# Altium project Control BoardPrjPcb.PrjPcb (part 1 of 2)
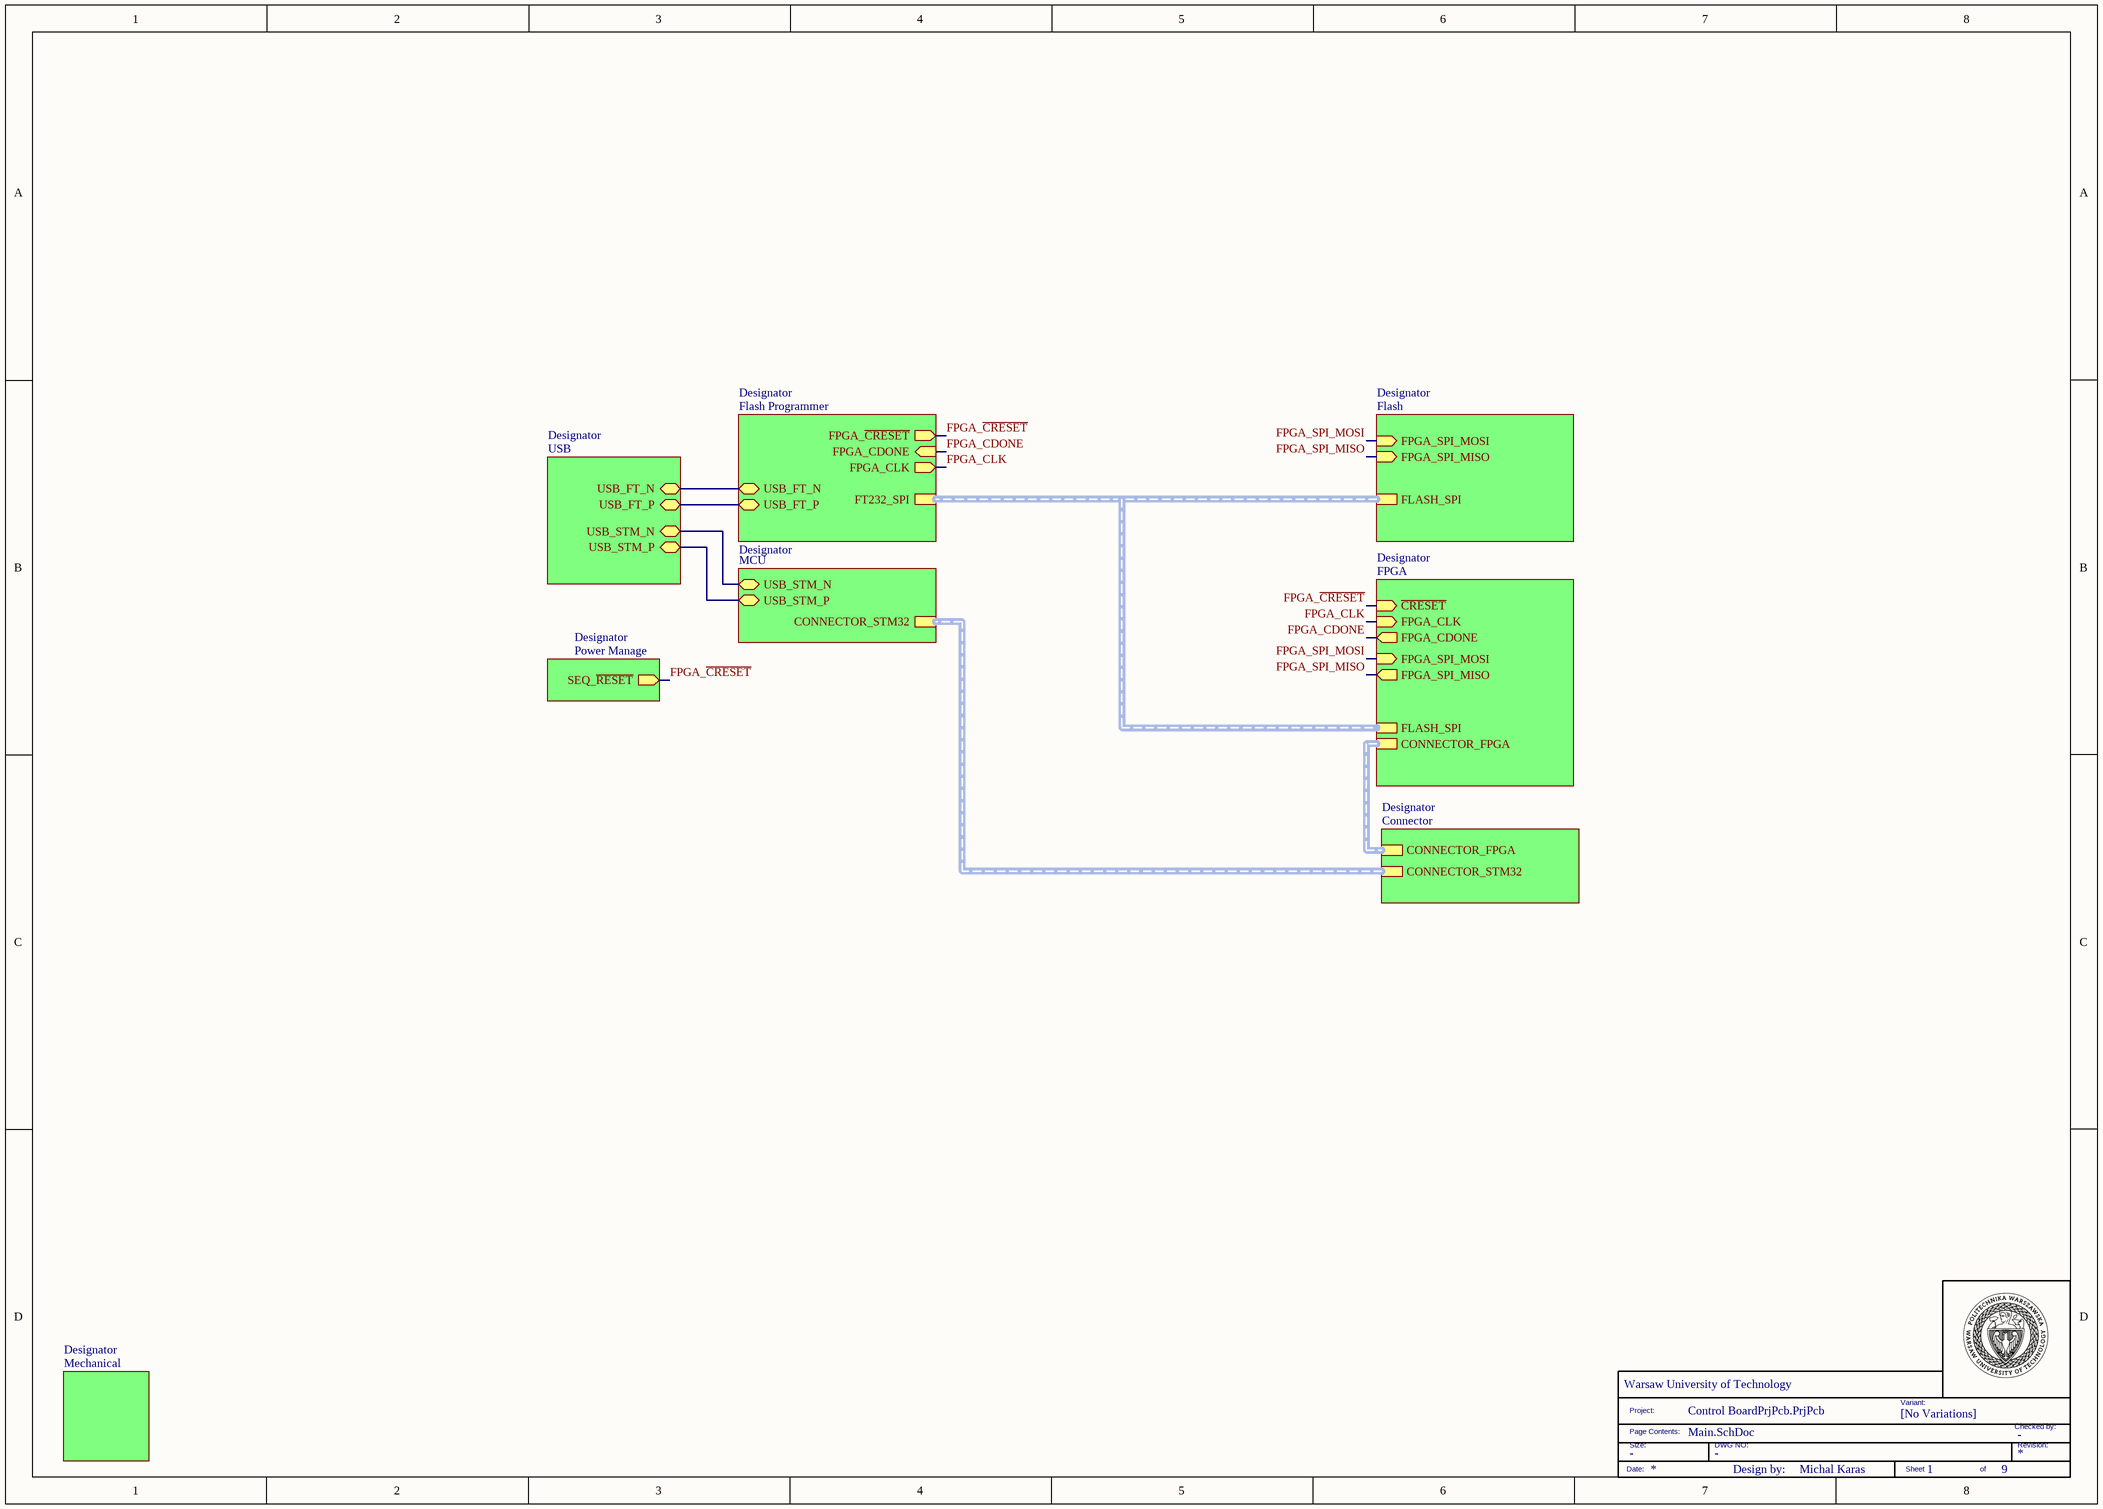
[diagram p0: Main.SchDoc]
9 sheets, 254 parts. Net scope: hierarchical (ports join the sheet entries above them; power ports are global).
Board file: Control Board.PcbDoc
Sheets:
  Main.SchDoc
    Designator = FPGA.SchDoc
    Designator = MCU.SchDoc
    Designator = Power Manage.SchDoc
    Designator = Mechanical.SchDoc
    Designator = USB.SchDoc
    Designator = Flash.SchDoc
    Designator = Flash Programmer.SchDoc
    Designator = Connector.SchDoc

## Sheet Main.SchDoc: CONTROL BOARD
size A3; Author: Michal Karas; CompanyName: Warsaw University of Technology; DrawnBy: Michal Karas; Engineer: Michal Karas; Organization: PW; SheetNumber: 1; SheetTotal: 9

### Parts
(Parts that share a designator on the sheet are numbered #1, #2 ... from top to bottom, then left to right.)
*#1  TITLE_BLOCK  (value not drawn)  (graphical)

### Sub-sheets
Designator = FPGA: ~{CRESET} (in), FPGA_CLK (in), FPGA_SPI_MOSI (in), FPGA_SPI_MISO (out), CONNECTOR_FPGA (harness CONNECTOR_FPGA), FPGA_CDONE (out), FLASH_SPI (harness FLASH_SPI)
Designator = MCU: USB_STM_N (bidir), USB_STM_P (bidir), CONNECTOR_STM32 (harness CONNECTOR_STM32)
Designator = Power Manage: SEQ_~{RESET} (out)
Designator = Mechanical: no entries
Designator = USB: USB_FT_N (bidir), USB_FT_P (bidir), USB_STM_N (bidir), USB_STM_P (bidir)
Designator = Flash: FPGA_SPI_MOSI (in), FPGA_SPI_MISO (in), FLASH_SPI (harness FLASH_SPI)
Designator = Flash Programmer: FPGA_~{CRESET} (out), FPGA_CDONE (in), FPGA_CLK (out), USB_FT_N (bidir), USB_FT_P (bidir), FT232_SPI (harness FLASH_SPI)
Designator = Connector: CONNECTOR_FPGA (harness CONNECTOR_FPGA), CONNECTOR_STM32 (harness CONNECTOR_STM32)

### Nets
FPGA_~{CRESET}: sheet Designator/~{CRESET}, sheet Designator/SEQ_~{RESET}, sheet Designator/FPGA_~{CRESET}  [project net ~{CRESET}]
FPGA_CDONE: sheet Designator/FPGA_CDONE, sheet Designator/FPGA_CDONE  [project net CDONE]
FPGA_CLK: sheet Designator/FPGA_CLK, sheet Designator/FPGA_CLK
FPGA_SPI_MISO: sheet Designator/FPGA_SPI_MISO, sheet Designator/FPGA_SPI_MISO
FPGA_SPI_MOSI: sheet Designator/FPGA_SPI_MOSI, sheet Designator/FPGA_SPI_MOSI
USB_FT_N: sheet Designator/USB_FT_N, sheet Designator/USB_FT_N
USB_FT_P: sheet Designator/USB_FT_P, sheet Designator/USB_FT_P
USB_STM_N: sheet Designator/USB_STM_N, sheet Designator/USB_STM_N
USB_STM_P: sheet Designator/USB_STM_P, sheet Designator/USB_STM_P

### Buses and harness runs
harness sheet Designator/FLASH_SPI = sheet Designator/FT232_SPI

### Notes on the sheet
- (in symbol CMP-003-000005-7) Variant:; Project:; [No Variations]; Checked by:; Page Contents:; Size:; DWG NO:; Revision:; Date:; Design by:; Sheet; of

### Library data of the parts
*#1 = CMP-003-000005-7: TITLEBLOCK; DWG NO: -; Size: -; Checked by: -; Design Item ID: TITLE_BLOCK; Source: TITLEBLOCK.SchLib

## Sheet FPGA.SchDoc
size A3; SheetNumber: 2; SheetTotal: 9
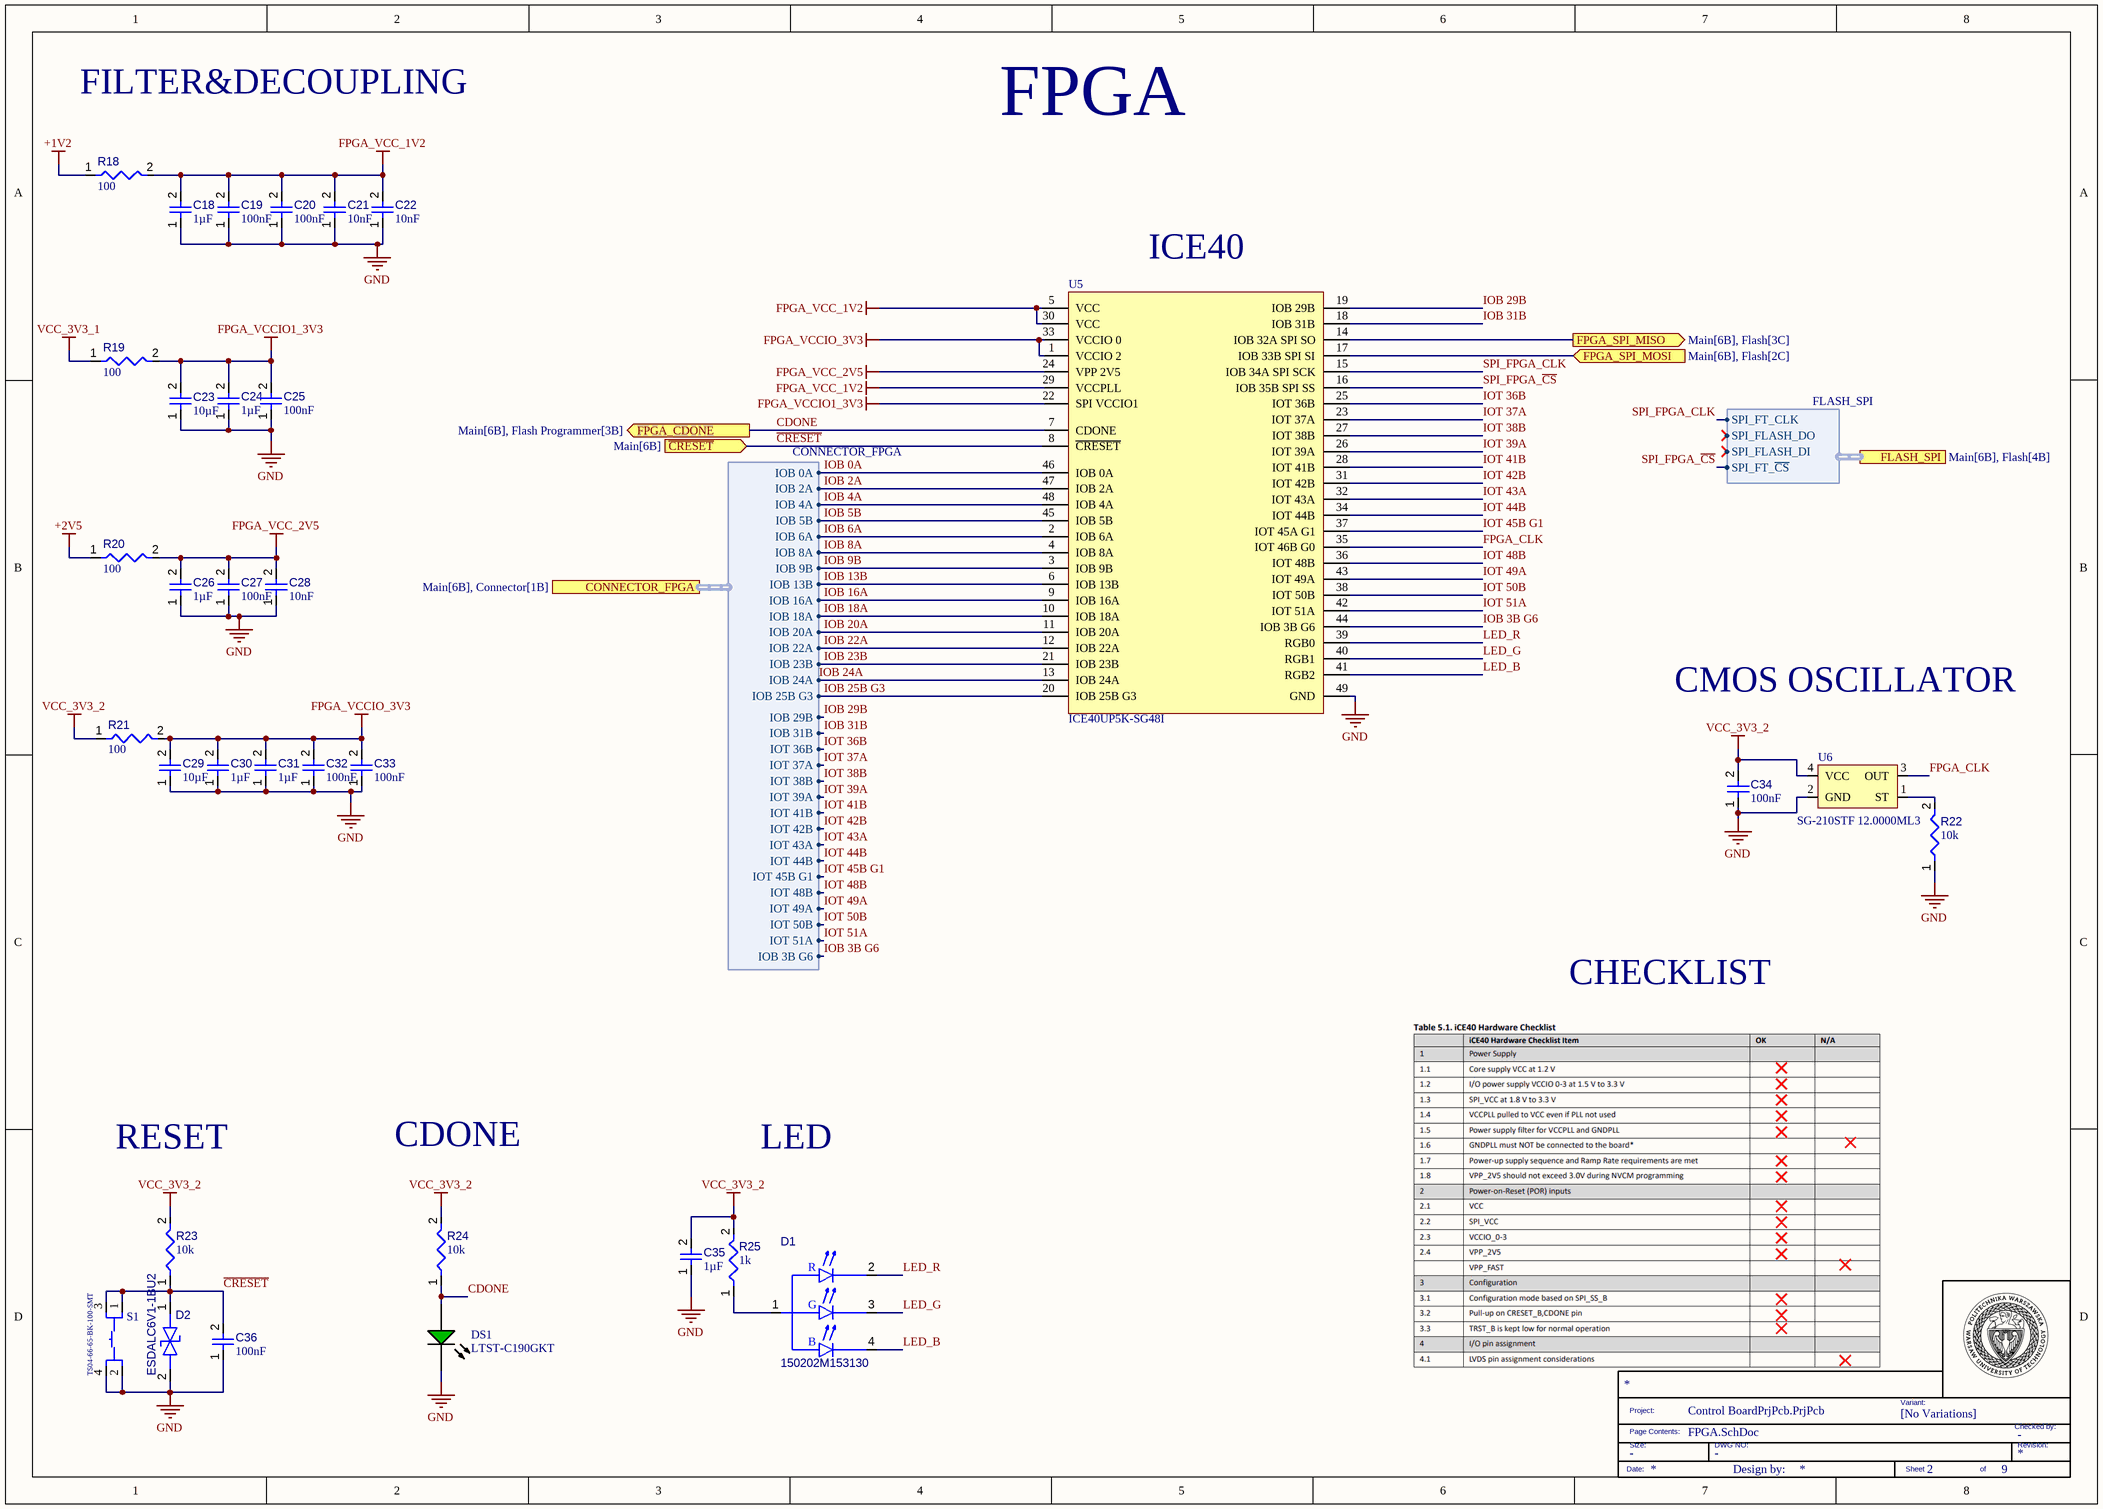
[diagram p1: FPGA.SchDoc]

### Parts
(Parts that share a designator on the sheet are numbered #1, #2 ... from top to bottom, then left to right.)
*?#1  TITLE_BLOCK  (value not drawn)  (graphical)
C18  value 1µF  [FP-CL10-IPC_C]  (hidden comment: CL10B105KA8NFNC)
C19  value 100nF  [FP-C0603C-CF-IPC_C]  (hidden comment: C0603C104K5RAC7411)
C20  value 100nF  [FP-C0603C-CF-IPC_C]  (hidden comment: C0603C104K5RAC7411)
C21  value 10nF  [CAPC1608X90X35LL10T15]  (hidden comment: GCM188R71H103KA37J)
C22  value 10nF  [CAPC1608X90X35LL10T15]  (hidden comment: GCM188R71H103KA37J)
C23  value 10µF  [FP-GRM188-0_2-IPC_C]  (hidden comment: GRM188R61C106MA73D)
C24  value 1µF  [FP-CL10-IPC_C]  (hidden comment: CL10B105KA8NFNC)
C25  value 100nF  [FP-C0603C-CF-IPC_C]  (hidden comment: C0603C104K5RAC7411)
C26  value 1µF  [FP-CL10-IPC_C]  (hidden comment: CL10B105KA8NFNC)
C27  value 100nF  [FP-C0603C-CF-IPC_C]  (hidden comment: C0603C104K5RAC7411)
C28  value 10nF  [CAPC1608X90X35LL10T15]  (hidden comment: GCM188R71H103KA37J)
C29  value 10µF  [FP-GRM188-0_2-IPC_C]  (hidden comment: GRM188R61C106MA73D)
C30  value 1µF  [FP-CL10-IPC_C]  (hidden comment: CL10B105KA8NFNC)
C31  value 1µF  [FP-CL10-IPC_C]  (hidden comment: CL10B105KA8NFNC)
C32  value 100nF  [FP-C0603C-CF-IPC_C]  (hidden comment: C0603C104K5RAC7411)
C33  value 100nF  [FP-C0603C-CF-IPC_C]  (hidden comment: C0603C104K5RAC7411)
C34  value 100nF  [FP-C0603C-CF-IPC_C]  (hidden comment: C0603C104K5RAC7411)
C35  value 1µF  [FP-CL10-IPC_C]  (hidden comment: CL10B105KA8NFNC)
C36  value 100nF  [FP-C0603C-CF-IPC_C]  (hidden comment: C0603C104K5RAC7411)
D1  150202M153130  [150202M153130-Footprint-1]
D2  ESDALC6V1-1BU2  [DIOC0603X03N]
DS1  LTST-C190GKT  [LTST-C190GKT_V]
R18  value 100  [RESC1608X06N]  (hidden comment: CRCW0603100RFKEAHP)
R19  value 100  [RESC1608X06N]  (hidden comment: CRCW0603100RFKEAHP)
R20  value 100  [RESC1608X06N]  (hidden comment: CRCW0603100RFKEAHP)
R21  value 100  [RESC1608X06N]  (hidden comment: CRCW0603100RFKEAHP)
R22  value 10k  [RESC1608X05N]  (hidden comment: CRCW060310K0FKTC)
R23  value 10k  [RESC1608X05N]  (hidden comment: CRCW060310K0FKTC)
R24  value 10k  [RESC1608X05N]  (hidden comment: CRCW060310K0FKTC)
R25  value 1k  [RESC1608X55X25LL10T15]  (hidden comment: Resistor 1k +/-1% 0603 100 mW)
S1  TS04-66-65-BK-100-SMT  [SW_TS04-66-65-BK-100-SMT]
U5  ICE40UP5K-SG48I  [FP-QFN-48-IPC_B]
U6  SG-210STF 12.0000ML3  [SG-210STF 12.0000ML3-Footprint-1]

### Ports
CONNECTOR_FPGA (harness CONNECTOR_FPGA, see Main[6B], Connector[1B]), FLASH_SPI (harness FLASH_SPI, see Main[6B], Flash[4B]), FPGA_CDONE (out, see Main[6B], Flash Programmer[3B]), FPGA_SPI_MISO (out, see Main[6B], Flash[3C]), FPGA_SPI_MOSI (in, see Main[6B], Flash[2C]), ~{CRESET} (in, see Main[6B])

### Harnesses
CONNECTOR_FPGA: IOB 0A, IOB 2A, IOB 4A, IOB 5B, IOB 6A, IOB 8A, IOB 9B, IOB 13B, IOB 16A, IOB 18A, IOB 20A, IOB 22A, IOB 23B, IOB 24A, IOB 25B G3, IOB 29B, IOB 31B, IOT 36B, IOT 37A, IOT 38B, IOT 39A, IOT 41B, IOT 42B, IOT 43A, IOT 44B, IOT 45B G1, IOT 48B, IOT 49A, IOT 50B, IOT 51A, IOB 3B G6
FLASH_SPI: SPI_FT_CLK, SPI_FLASH_DO, SPI_FLASH_DI, SPI_FT_~{CS}

### Nets
+1V2: R18.1
+2V5: R20.1
FPGA_VCC_1V2: C18.2 C19.2 C20.2 C21.2 C22.2 R18.2 U5.5(VCC) U5.29(VCCPLL) U5.30(VCC)
FPGA_VCC_2V5: C26.2 C27.2 C28.2 R20.2 U5.24(VPP_2V5)
FPGA_VCCIO1_3V3: C23.2 C24.2 C25.2 R19.2 U5.22(SPI_VCCIO1)
FPGA_VCCIO_3V3: C29.2 C30.2 C31.2 C32.2 C33.2 R21.2 U5.1(VCCIO_2) U5.33(VCCIO_0)
GND: C18.1 C19.1 C20.1 C21.1 C22.1 C23.1 C24.1 C25.1 C26.1 C27.1 C28.1 C29.1 C30.1 C31.1 C32.1 C33.1 C34.1 C35.1 C36.1 D2.2(A) DS1.2(K) R22.1 S1.2 S1.4 U5.49(GND) U6.2(GND)
VCC_3V3_1: R19.1
VCC_3V3_2: C34.2 C35.2 R21.1 R23.2 R24.2 R25.2 U6.4(VCC)
~{CRESET}: C36.2 D2.1(K) R23.1 S1.1 S1.3 U5.8(~{CRESET}) ; port ~{CRESET}
CDONE: DS1.1(A) R24.1 U5.7(CDONE) ; port FPGA_CDONE
FPGA_CLK: U5.35(IOT_46B_G0) U6.3(OUT)
FPGA_SPI_MISO: U5.14(IOB_32A_SPI_SO) ; port FPGA_SPI_MISO
FPGA_SPI_MOSI: U5.17(IOB_33B_SPI_SI) ; port FPGA_SPI_MOSI
IOB 0A: U5.46(IOB_0A) ; port CONNECTOR_FPGA.IOB 0A
IOB 2A: U5.47(IOB_2A) ; port CONNECTOR_FPGA.IOB 2A
IOB 3B G6: U5.44(IOB_3B_G6) ; port CONNECTOR_FPGA.IOB 3B G6
IOB 4A: U5.48(IOB_4A) ; port CONNECTOR_FPGA.IOB 4A
IOB 5B: U5.45(IOB_5B) ; port CONNECTOR_FPGA.IOB 5B
IOB 6A: U5.2(IOB_6A) ; port CONNECTOR_FPGA.IOB 6A
IOB 8A: U5.4(IOB_8A) ; port CONNECTOR_FPGA.IOB 8A
IOB 9B: U5.3(IOB_9B) ; port CONNECTOR_FPGA.IOB 9B
IOB 13B: U5.6(IOB_13B) ; port CONNECTOR_FPGA.IOB 13B
IOB 16A: U5.9(IOB_16A) ; port CONNECTOR_FPGA.IOB 16A
IOB 18A: U5.10(IOB_18A) ; port CONNECTOR_FPGA.IOB 18A
IOB 20A: U5.11(IOB_20A) ; port CONNECTOR_FPGA.IOB 20A
IOB 22A: U5.12(IOB_22A) ; port CONNECTOR_FPGA.IOB 22A
IOB 23B: U5.21(IOB_23B) ; port CONNECTOR_FPGA.IOB 23B
IOB 24A: U5.13(IOB_24A) ; port CONNECTOR_FPGA.IOB 24A
IOB 25B G3: U5.20(IOB_25B_G3) ; port CONNECTOR_FPGA.IOB 25B G3
IOB 29B: U5.19(IOB_29B) ; port CONNECTOR_FPGA.IOB 29B
IOB 31B: U5.18(IOB_31B) ; port CONNECTOR_FPGA.IOB 31B
IOT 36B: U5.25(IOT_36B) ; port CONNECTOR_FPGA.IOT 36B
IOT 37A: U5.23(IOT_37A) ; port CONNECTOR_FPGA.IOT 37A
IOT 38B: U5.27(IOT_38B) ; port CONNECTOR_FPGA.IOT 38B
IOT 39A: U5.26(IOT_39A) ; port CONNECTOR_FPGA.IOT 39A
IOT 41B: U5.28(IOT_41B) ; port CONNECTOR_FPGA.IOT 41B
IOT 42B: U5.31(IOT_42B) ; port CONNECTOR_FPGA.IOT 42B
IOT 43A: U5.32(IOT_43A) ; port CONNECTOR_FPGA.IOT 43A
IOT 44B: U5.34(IOT_44B) ; port CONNECTOR_FPGA.IOT 44B
IOT 45B G1: U5.37(IOT_45A_G1) ; port CONNECTOR_FPGA.IOT 45B G1
IOT 48B: U5.36(IOT_48B) ; port CONNECTOR_FPGA.IOT 48B
IOT 49A: U5.43(IOT_49A) ; port CONNECTOR_FPGA.IOT 49A
IOT 50B: U5.38(IOT_50B) ; port CONNECTOR_FPGA.IOT 50B
IOT 51A: U5.42(IOT_51A) ; port CONNECTOR_FPGA.IOT 51A
LED_B: D1.4(K) U5.41(RGB2)
LED_G: D1.3(K) U5.40(RGB1)
LED_R: D1.2(A) U5.39(RGB0)
SPI_FPGA_~{CS}: U5.16(IOB_35B_SPI_SS) ; port FLASH_SPI.SPI_FT_~{CS}
SPI_FPGA_CLK: U5.15(IOB_34A_SPI_SCK) ; port FLASH_SPI.SPI_FT_CLK  [project net FLASH_SPI_SCK]
NetD1_1: D1.1(A) R25.1
NetR22_2: R22.2 U6.1(ST)

### Notes on the sheet
- FILTER&DECOUPLING
- FPGA
- (near U5) ICE40
- CMOS OSCILLATOR
- CHECKLIST
- RESET
- CDONE
- LED
- Rpullup=1/(2*ConfigFrequency*CDONETraceCap)
- CDONE IS 1 IF FPGA IS CONFIGURED
- (in symbol CMP-003-000005-7) Variant:; Project:; [No Variations]; Checked by:; Page Contents:; Size:; DWG NO:; Revision:; Date:; Design by:; Sheet; of
- (in symbol CMP-007-00037-1) R; G; B

### Library data of the parts
*?#1 = CMP-003-000005-7: TITLEBLOCK; DWG NO: -; Size: -; Checked by: -; Design Item ID: TITLE_BLOCK; Source: TITLEBLOCK.SchLib
C18 C24 C26 C30 C31 C35 = CMP-001-00085-5: Ceramic Capacitor, Multilayer, Ceramic, 25V, 10% +Tol, 10% -Tol, X7R, 15% TC, 1uF, Surface Mount, 0603; Max Operating Temperature: 125°C; Pins: 2; RoHS Compliant: Yes; Min Operating Temperature: -55°C; Capacitor Type: Ceramic; Mounting Technology: Surface Mount; Case/Package: 0603
C19 C20 = CMP-001-00086-4: Ceramic Capacitor, Multilayer, Ceramic, 50V, 10% +Tol, 10% -Tol, X7R, 15% TC, 0.1uF, Surface Mount, 0603; Capacitor Type: Ceramic; Max Operating Temperature: 125°C; Case/Package: 0603; Pins: 2; Min Operating Temperature: -55°C; RoHS Compliant: Yes; Mounting Technology: Surface Mount
C21 C22 C28 = CMP-001-00231-2: Ceramic Capacitor, Multilayer, Ceramic, 50V, 10% +Tol, 10% -Tol, X7R, 15% TC, 0.01uF, Surface Mount, 0603; Min Operating Temperature: -55°C; Voltage Rating: 50V; Max Operating Temperature: 125°C; Tolerance: 10%; Capacitor Type: Ceramic; Mounting Technology: Surface Mount; RoHS Compliant: Yes; Case/Package: 0603; Pins: 2
C23 C29 = CMP-001-00241-5: Ceramic Capacitor, Multilayer, Ceramic, 16V, 20% +Tol, 20% -Tol, X5R, 15% TC, 10uF, Surface Mount, 0603; Min Operating Temperature: -55°C; Capacitor Type: Ceramic; RoHS Compliant: Yes; Max Operating Temperature: 85°C; Case/Package: 0603; Mounting Technology: Surface Mount; Pins: 2
C25 C27 C32-C34 C36 = CMP-001-00086-8: Ceramic Capacitor, Multilayer, Ceramic, 50V, 10% +Tol, 10% -Tol, X7R, 15% TC, 0.1uF, Surface Mount, 0603; Capacitor Type: Ceramic; Max Operating Temperature: 125°C; Case/Package: 0603; Pins: 2; Min Operating Temperature: -55°C; RoHS Compliant: Yes; Mounting Technology: Surface Mount
D1 = CMP-007-00037-1: Standard LEDs - SMD WL-SFTD Diffsd TopVw RGB 3.2V 20mA 635nm; Max Power Dissipation: 72mW; Min Operating Temperature: -40°C; Max Operating Temperature: 85°C; Pins: 4; Forward Voltage: 3.2V; Forward Current: 20mA; Colour: RGB; Nominal Vf: 3.2V
D2 = CMP-004-00032-2: Trans Voltage Suppressor Diode, Bidirectional, 1 Element, Silicon; Forward Current: 100nA; Peak Inverse Voltage: 6.1V; Forward Voltage: 3V; Max Surge Current: 1.5A; Max Operating Temperature: 125°C; Min Operating Temperature: -40°C; Case/Package: 0201; Pins: 2; RoHS Compliant: Yes
DS1 = CMP-007-00022-2: LED Uni-Color Green, 100 mW, 30 mA, -55 to 85 degC, 2-Pin SMD, RoHS, Tape and Reel; Manufacturer: Lite-On; Power: 100mW; Forward Voltage: 2.1V; Viewing Angle: 130degrees; Forward Current: 20mA; Luminous Intensity: 6mcd; Lens Style: Clear; Manufacturer URL: http://www.us.liteon.com/; RoHS Compliant: True; Colour: Green; Package Description: 2-Pin Surface Mount Device, Body 1.6 x 0.8 mm; Datasheet URL: http://datasheet.octopart.com/LTST-C190GKT-Lite-On-datasheet-158530.pdf; Datasheet Version: Dec-06; Mounting Technology: SM; Case/Package: 0603; Package Reference: C190GKT; Packaging: TapeandReel; Min Operating Temperature: -55°C; Nominal Vf: 2.1V; Package Quantity: 3000; Illumination Colour: Green; Max Operating Temperature: 85°C; Pins: 2
R18-R21 = CMP-009-00188-2: Fixed Resistor, Metal Glaze/thick Film, 0.33W, 100ohm, 75V, 1% +/-Tol, 100ppm/Cel, Surface Mount, 0603; Power: 250mW; Pins: 2; Case/Package: 0603; Max Operating Temperature: 155°C; Tolerance: 1%; Min Operating Temperature: -55°C; Mounting Technology: Surface Mount; RoHS Compliant: Yes
R22 R23 = CMP-009-00187-2: Fixed Resistor, Metal Glaze/thick Film, 0.1W, 10000ohm, 75V, 1% +/-Tol, 100ppm/Cel, Surface Mount, 0603; Power: 100mW; Voltage Rating: 75V; Case/Package: 0603; Tolerance: 1%; Min Operating Temperature: -55°C; Mounting Technology: Surface Mount; Max Operating Temperature: 155°C; RoHS Compliant: No; Pins: 2
R24 = CMP-009-00187-3: Fixed Resistor, Metal Glaze/thick Film, 0.1W, 10000ohm, 75V, 1% +/-Tol, 100ppm/Cel, Surface Mount, 0603; Power: 100mW; Voltage Rating: 75V; Case/Package: 0603; Tolerance: 1%; Min Operating Temperature: -55°C; Mounting Technology: Surface Mount; Max Operating Temperature: 155°C; RoHS Compliant: No; Pins: 2
R25 = CMP-009-00014-6: Chip Resistor, 1 KOhm, +/-1%, 0.1 W, -55 to 155 degC, 0603 (1608 Metric); Voltage Rating: 50V; Power: 100mW; Tolerance: 1%; Mounting Technology: SM; Pins: 2; Case/Package: 0603; Min Operating Temperature: -55°C; RoHS Compliant: True; Max Operating Temperature: 155°C
S1 = CMP-015-000000-3: Switch Tactile OFF (ON) SPST Round Button Gull Wing 0.05A 12VDC 100000Cycles 1N SMD Bag; Package: None; MP: TS04-66-65-BK-100-SMT; Availability: Unavailable; Source: TS04-66-65-BK-100-SMT.SchLib; Pin Count: 4; Design Item ID: TS04-66-65-BK-100-SMT; Value: *; Component Type: Standard; Price: None
U5 = CMP-020-00024-5: Field Programmable Gate Array; Min Supply Voltage: 1.2V; Max Supply Voltage: 3.6V; I/Os: 39; Clock Frequency: 50MHz; RoHS Compliant: Yes; Case/Package: QFN; Pins: 49; Frequency: 50MHz
U6 = CMP-003-00030-6: CMOS Output Clock Oscillator, 12MHz Nom; Load Capacitance: 15pF; Frequency: 12MHz; Max Operating Temperature: 85°C; Min Operating Temperature: -40°C; Pins: 4

## Sheet MCU.SchDoc
size A3; SheetNumber: 3; SheetTotal: 9
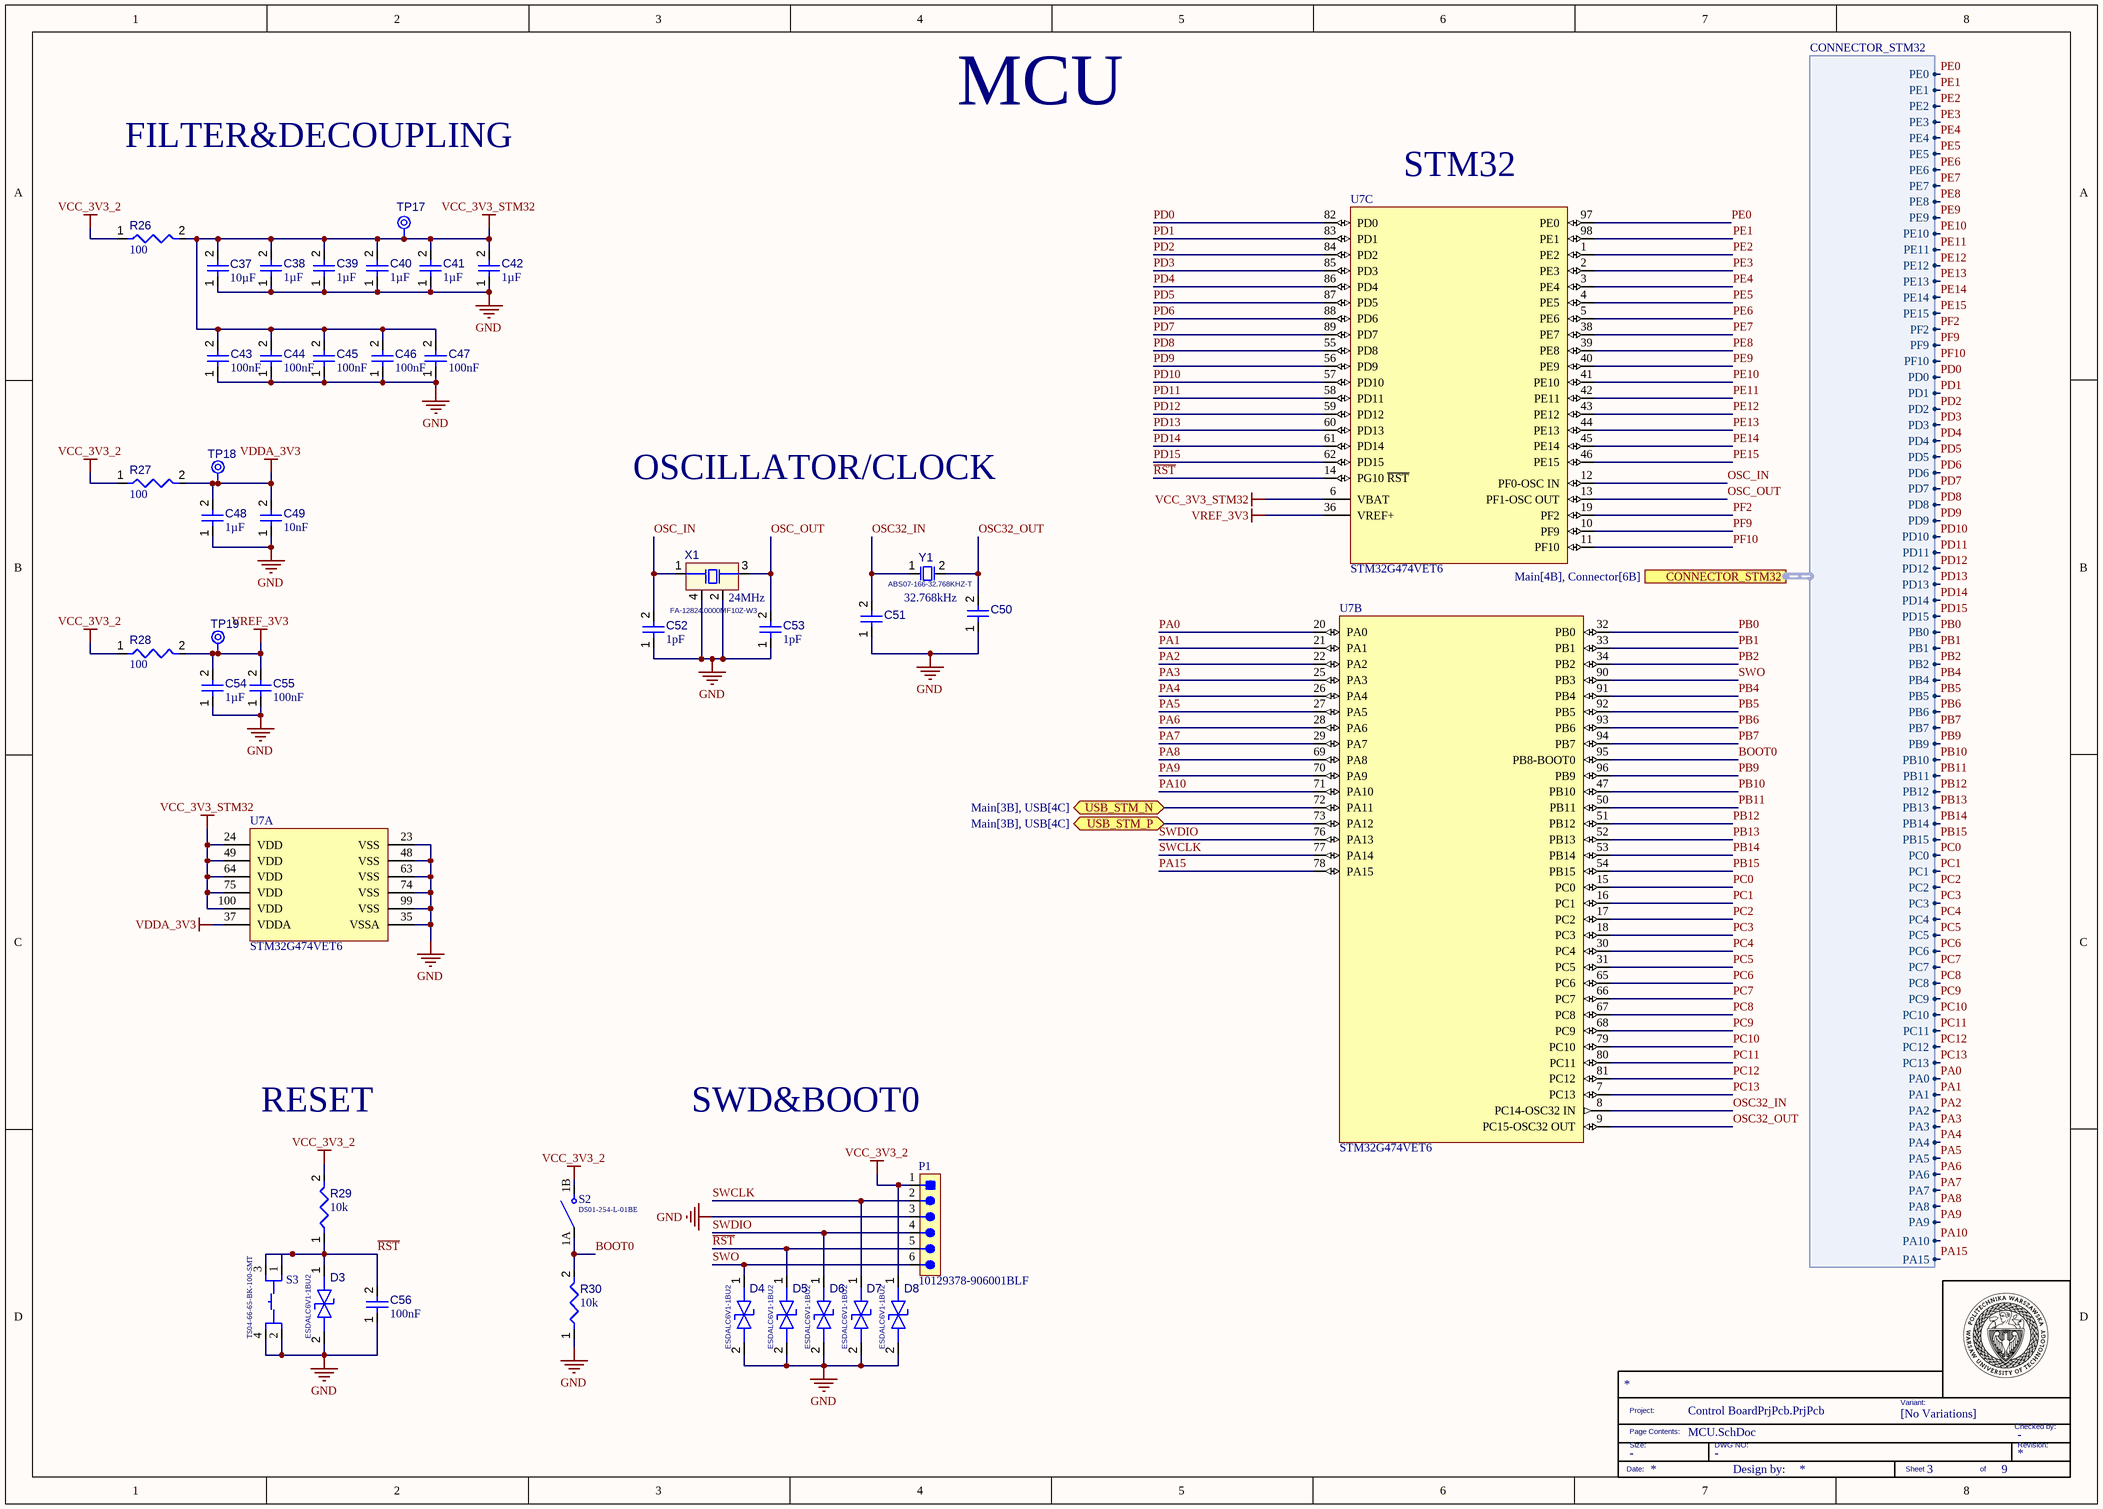
[diagram p2: MCU.SchDoc]

### Parts
(Parts that share a designator on the sheet are numbered #1, #2 ... from top to bottom, then left to right.)
*?#2  TITLE_BLOCK  (value not drawn)  (graphical)
C37  value 10µF  [FP-GRM188-0_2-IPC_C]  (hidden comment: GRM188R61C106MA73D)
C38  value 1µF  [FP-CL10-IPC_C]  (hidden comment: CL10B105KA8NFNC)
C39  value 1µF  [FP-CL10-IPC_C]  (hidden comment: CL10B105KA8NFNC)
C40  value 1µF  [FP-CL10-IPC_C]  (hidden comment: CL10B105KA8NFNC)
C41  value 1µF  [FP-CL10-IPC_C]  (hidden comment: CL10B105KA8NFNC)
C42  value 1µF  [FP-CL10-IPC_C]  (hidden comment: CL10B105KA8NFNC)
C43  value 100nF  [FP-C0603C-CF-IPC_C]  (hidden comment: C0603C104K5RAC7411)
C44  value 100nF  [FP-C0603C-CF-IPC_C]  (hidden comment: C0603C104K5RAC7411)
C45  value 100nF  [FP-C0603C-CF-IPC_C]  (hidden comment: C0603C104K5RAC7411)
C46  value 100nF  [FP-C0603C-CF-IPC_C]  (hidden comment: C0603C104K5RAC7411)
C47  value 100nF  [FP-C0603C-CF-IPC_C]  (hidden comment: C0603C104K5RAC7411)
C48  value 1µF  [FP-CL10-IPC_C]  (hidden comment: CL10B105KA8NFNC)
C49  value 10nF  [CAPC1608X90X35LL10T15]  (hidden comment: GCM188R71H103KA37J)
C50  C0402C479D8HACAUTO  [FP-C0402-BB-MFG]  (value not drawn)
C51  C0402C479D8HACAUTO  [FP-C0402-BB-MFG]  (value not drawn)
C52  value 1pF  [CAPC1005X06N]  (hidden comment: CBR04C109B5GACAUTO)
C53  value 1pF  [CAPC1005X06N]  (hidden comment: CBR04C109B5GACAUTO)
C54  value 1µF  [FP-CL10-IPC_C]  (hidden comment: CL10B105KA8NFNC)
C55  value 100nF  [FP-C0603C-CF-IPC_C]  (hidden comment: C0603C104K5RAC7411)
C56  value 100nF  [FP-C0603C-CF-IPC_C]  (hidden comment: C0603C104K5RAC7411)
D3  ESDALC6V1-1BU2  [DIOC0603X03N]
D4  ESDALC6V1-1BU2  [DIOC0603X03N]
D5  ESDALC6V1-1BU2  [DIOC0603X03N]
D6  ESDALC6V1-1BU2  [DIOC0603X03N]
D7  ESDALC6V1-1BU2  [DIOC0603X03N]
D8  ESDALC6V1-1BU2  [DIOC0603X03N]
P1  10129378-906001BLF  [10129378-906001BLF-Footprint-1]
R26  value 100  [RESC1608X06N]  (hidden comment: CRCW0603100RFKEAHP)
R27  value 100  [RESC1608X06N]  (hidden comment: CRCW0603100RFKEAHP)
R28  value 100  [RESC1608X06N]  (hidden comment: CRCW0603100RFKEAHP)
R29  value 10k  [RESC1608X05N]  (hidden comment: CRCW060310K0FKTC)
R30  value 10k  [RESC1608X05N]  (hidden comment: CRCW060310K0FKTC)
S2  DS01-254-L-01BE  [SW_DS01-254-L-01BE]
S3  TS04-66-65-BK-100-SMT  [SW_TS04-66-65-BK-100-SMT]
TP17  TPAD6R  [TP06R]  (value not drawn)  (no BOM)
TP18  TPAD6R  [TP06R]  (value not drawn)  (no BOM)
TP19  TPAD6R  [TP06R]  (value not drawn)  (no BOM)
U7  STM32G474VET6  [FP-LQFP100-1L-IPC_B]  (parts A,B,C of 3)
X1  FA-12824.0000MF10Z-W3  Frequency: 24MHz  [EPSON-FA-128_V]
Y1  ABS07-166-32.768KHZ-T  Frequency: 32.768kHz  [EPSON-FC-135_V]

### Ports
CONNECTOR_STM32 (harness CONNECTOR_STM32, see Main[4B], Connector[6B]), USB_STM_N (bidir, see Main[3B], USB[4C]), USB_STM_P (bidir, see Main[3B], USB[4C])

### Harnesses
CONNECTOR_STM32: PE0, PE1, PE2, PE3, PE4, PE5, PE6, PE7, PE8, PE9, PE10, PE11, PE12, PE13, PE14, PE15, PF2, PF9, PF10, PD0, PD1, PD2, PD3, PD4, PD5, PD6, PD7, PD8, PD9, PD10, PD11, PD12, PD13, PD14, PD15, PB0, PB1, PB2, PB4, PB5, PB6, PB7, PB9, PB10, PB11, PB12, PB13, PB14, PB15, PC0, PC1, PC2, PC3, PC4, PC5, PC6, PC7, PC8, PC9, PC10, PC11, PC12, PC13, PA0, PA1, PA2, PA3, PA4, PA5, PA6, PA7, PA8, PA9, PA10, PA15

### Nets
GND: C37.1 C38.1 C39.1 C40.1 C41.1 C42.1 C43.1 C44.1 C45.1 C46.1 C47.1 C48.1 C49.1 C50.1 C51.1 C52.1 C53.1 C54.1 C55.1 C56.1 D3.2(A) D4.2(A) D5.2(A) D6.2(A) D7.2(A) D8.2(A) P1.3 R30.1 S3.2 S3.4 U7.23(VSS) U7.35(VSSA) U7.48(VSS) U7.63(VSS) U7.74(VSS) U7.99(VSS) X1.2(NC) X1.4(NC)
VCC_3V3_2: D8.1(K) P1.1 R26.1 R27.1 R28.1 R29.2 S2.1B(NO1)
VCC_3V3_STM32: C37.2 C38.2 C39.2 C40.2 C41.2 C42.2 C43.2 C44.2 C45.2 C46.2 C47.2 R26.2 TP17.1(TP) U7.6(VBAT) U7.24(VDD) U7.49(VDD) U7.64(VDD) U7.75(VDD) U7.100(VDD)
VDDA_3V3: C48.2 C49.2 R27.2 TP18.1(TP) U7.37(VDDA)
VREF_3V3: C54.2 C55.2 R28.2 TP19.1(TP) U7.36(VREF+)
~{RST}: C56.2 D3.1(K) D5.1(K) P1.5 R29.1 S3.1 S3.3 U7.14(PG10_~{RST})
BOOT0: R30.2 S2.1A(COM1) U7.95(PB8-BOOT0)
OSC32_IN: C51.2 U7.8(PC14-OSC32_IN) Y1.1
OSC32_OUT: C50.2 U7.9(PC15-OSC32_OUT) Y1.2
OSC_IN: C52.2 U7.12(PF0-OSC_IN) X1.1(X1)
OSC_OUT: C53.2 U7.13(PF1-OSC_OUT) X1.3(X2)
PA0: U7.20(PA0) ; port CONNECTOR_STM32.PA0
PA1: U7.21(PA1) ; port CONNECTOR_STM32.PA1
PA2: U7.22(PA2) ; port CONNECTOR_STM32.PA2
PA3: U7.25(PA3) ; port CONNECTOR_STM32.PA3
PA4: U7.26(PA4) ; port CONNECTOR_STM32.PA4
PA5: U7.27(PA5) ; port CONNECTOR_STM32.PA5
PA6: U7.28(PA6) ; port CONNECTOR_STM32.PA6
PA7: U7.29(PA7) ; port CONNECTOR_STM32.PA7
PA8: U7.69(PA8) ; port CONNECTOR_STM32.PA8
PA9: U7.70(PA9) ; port CONNECTOR_STM32.PA9
PA10: U7.71(PA10) ; port CONNECTOR_STM32.PA10
PA15: U7.78(PA15) ; port CONNECTOR_STM32.PA15
PB0: U7.32(PB0) ; port CONNECTOR_STM32.PB0
PB1: U7.33(PB1) ; port CONNECTOR_STM32.PB1
PB2: U7.34(PB2) ; port CONNECTOR_STM32.PB2
PB4: U7.91(PB4) ; port CONNECTOR_STM32.PB4
PB5: U7.92(PB5) ; port CONNECTOR_STM32.PB5
PB6: U7.93(PB6) ; port CONNECTOR_STM32.PB6
PB7: U7.94(PB7) ; port CONNECTOR_STM32.PB7
PB9: U7.96(PB9) ; port CONNECTOR_STM32.PB9
PB10: U7.47(PB10) ; port CONNECTOR_STM32.PB10
PB11: U7.50(PB11) ; port CONNECTOR_STM32.PB11
PB12: U7.51(PB12) ; port CONNECTOR_STM32.PB12
PB13: U7.52(PB13) ; port CONNECTOR_STM32.PB13
PB14: U7.53(PB14) ; port CONNECTOR_STM32.PB14
PB15: U7.54(PB15) ; port CONNECTOR_STM32.PB15
PC0: U7.15(PC0) ; port CONNECTOR_STM32.PC0
PC1: U7.16(PC1) ; port CONNECTOR_STM32.PC1
PC2: U7.17(PC2) ; port CONNECTOR_STM32.PC2
PC3: U7.18(PC3) ; port CONNECTOR_STM32.PC3
PC4: U7.30(PC4) ; port CONNECTOR_STM32.PC4
PC5: U7.31(PC5) ; port CONNECTOR_STM32.PC5
PC6: U7.65(PC6) ; port CONNECTOR_STM32.PC6
PC7: U7.66(PC7) ; port CONNECTOR_STM32.PC7
PC8: U7.67(PC8) ; port CONNECTOR_STM32.PC8
PC9: U7.68(PC9) ; port CONNECTOR_STM32.PC9
PC10: U7.79(PC10) ; port CONNECTOR_STM32.PC10
PC11: U7.80(PC11) ; port CONNECTOR_STM32.PC11
PC12: U7.81(PC12) ; port CONNECTOR_STM32.PC12
PC13: U7.7(PC13) ; port CONNECTOR_STM32.PC13
PD0: U7.82(PD0) ; port CONNECTOR_STM32.PD0
PD1: U7.83(PD1) ; port CONNECTOR_STM32.PD1
PD2: U7.84(PD2) ; port CONNECTOR_STM32.PD2
PD3: U7.85(PD3) ; port CONNECTOR_STM32.PD3
PD4: U7.86(PD4) ; port CONNECTOR_STM32.PD4
PD5: U7.87(PD5) ; port CONNECTOR_STM32.PD5
PD6: U7.88(PD6) ; port CONNECTOR_STM32.PD6
PD7: U7.89(PD7) ; port CONNECTOR_STM32.PD7
PD8: U7.55(PD8) ; port CONNECTOR_STM32.PD8
PD9: U7.56(PD9) ; port CONNECTOR_STM32.PD9
PD10: U7.57(PD10) ; port CONNECTOR_STM32.PD10
PD11: U7.58(PD11) ; port CONNECTOR_STM32.PD11
PD12: U7.59(PD12) ; port CONNECTOR_STM32.PD12
PD13: U7.60(PD13) ; port CONNECTOR_STM32.PD13
PD14: U7.61(PD14) ; port CONNECTOR_STM32.PD14
PD15: U7.62(PD15) ; port CONNECTOR_STM32.PD15
PE0: U7.97(PE0) ; port CONNECTOR_STM32.PE0
PE1: U7.98(PE1) ; port CONNECTOR_STM32.PE1
PE2: U7.1(PE2) ; port CONNECTOR_STM32.PE2
PE3: U7.2(PE3) ; port CONNECTOR_STM32.PE3
PE4: U7.3(PE4) ; port CONNECTOR_STM32.PE4
PE5: U7.4(PE5) ; port CONNECTOR_STM32.PE5
PE6: U7.5(PE6) ; port CONNECTOR_STM32.PE6
PE7: U7.38(PE7) ; port CONNECTOR_STM32.PE7
PE8: U7.39(PE8) ; port CONNECTOR_STM32.PE8
PE9: U7.40(PE9) ; port CONNECTOR_STM32.PE9
PE10: U7.41(PE10) ; port CONNECTOR_STM32.PE10
PE11: U7.42(PE11) ; port CONNECTOR_STM32.PE11
PE12: U7.43(PE12) ; port CONNECTOR_STM32.PE12
PE13: U7.44(PE13) ; port CONNECTOR_STM32.PE13
PE14: U7.45(PE14) ; port CONNECTOR_STM32.PE14
PE15: U7.46(PE15) ; port CONNECTOR_STM32.PE15
PF2: U7.19(PF2) ; port CONNECTOR_STM32.PF2
PF9: U7.10(PF9) ; port CONNECTOR_STM32.PF9
PF10: U7.11(PF10) ; port CONNECTOR_STM32.PF10
SWCLK: D7.1(K) P1.2 U7.77(PA14)
SWDIO: D6.1(K) P1.4 U7.76(PA13)
SWO: D4.1(K) P1.6 U7.90(PB3)
USB_STM_N: U7.72(PA11) ; port USB_STM_N
USB_STM_P: U7.73(PA12) ; port USB_STM_P

### Notes on the sheet
- FILTER&DECOUPLING
- MCU
- (near U7) STM32
- OSCILLATOR/CLOCK
- Battery not used
- RESET
- SWD&BOOT0
- (in symbol CMP-003-000005-7) Variant:; Project:; [No Variations]; Checked by:; Page Contents:; Size:; DWG NO:; Revision:; Date:; Design by:; Sheet; of

### Library data of the parts
*?#2 = CMP-003-000005-7: TITLEBLOCK; DWG NO: -; Size: -; Checked by: -; Design Item ID: TITLE_BLOCK; Source: TITLEBLOCK.SchLib
C37 = CMP-001-00241-5: as C23 on sheet FPGA; Min Operating Temperature: -55°C; Capacitor Type: Ceramic; RoHS Compliant: Yes; Max Operating Temperature: 85°C; Case/Package: 0603; Mounting Technology: Surface Mount; Pins: 2
C38-C42 C48 C54 = CMP-001-00085-5: as C18 on sheet FPGA; Max Operating Temperature: 125°C; Pins: 2; RoHS Compliant: Yes; Min Operating Temperature: -55°C; Capacitor Type: Ceramic; Mounting Technology: Surface Mount; Case/Package: 0603
C43-C47 C55 C56 = CMP-001-00086-8: as C25 on sheet FPGA; Capacitor Type: Ceramic; Max Operating Temperature: 125°C; Case/Package: 0603; Pins: 2; Min Operating Temperature: -55°C; RoHS Compliant: Yes; Mounting Technology: Surface Mount
C49 = CMP-001-00231-2: as C21 on sheet FPGA; Min Operating Temperature: -55°C; Voltage Rating: 50V; Max Operating Temperature: 125°C; Tolerance: 10%; Capacitor Type: Ceramic; Mounting Technology: Surface Mount; RoHS Compliant: Yes; Case/Package: 0603; Pins: 2
C50 C51 = CMP-001-00239-1: Cap Cer 0402 4.7PF 10V Ultra Sta; RoHS Compliant: Yes
C52 C53 = CMP-001-00240-1: Cap Cer 1PF 50V C0G/NP0 0402; Capacitor Type: NP0; Tolerance: 10%; Pins: 2; Voltage Rating: 50V; Max Operating Temperature: 125°C; Case/Package: 0402; Min Operating Temperature: -55°C
D3-D8 = CMP-004-00032-2: as D2 on sheet FPGA; Max Operating Temperature: 125°C; Min Operating Temperature: -40°C; Case/Package: 0201; Pins: 2; RoHS Compliant: Yes
P1 = CMP-002-00071-1: Headers & Wire Housings ECONOSTIK HEADER SR VT TH 1X6; Connector Type: Pin Strip; Voltage Rating: 110V; Gender: Male; Max Current Rating: 3A; Pins: 6; Max Operating Temperature: -40°C; Min Operating Temperature: 105°C
R26-R28 = CMP-009-00188-2: as R18 on sheet FPGA; Pins: 2; Case/Package: 0603; Max Operating Temperature: 155°C; Tolerance: 1%; Min Operating Temperature: -55°C; Mounting Technology: Surface Mount; RoHS Compliant: Yes
R29 R30 = CMP-009-00187-2: as R22 on sheet FPGA; Voltage Rating: 75V; Case/Package: 0603; Tolerance: 1%; Min Operating Temperature: -55°C; Mounting Technology: Surface Mount; Max Operating Temperature: 155°C; RoHS Compliant: No; Pins: 2
S2 = CMP-011-00013-2: 1 Position, Through Hole, 2.54 mm Pitch, Raised Slide Actuator, Flat Bottom, Long Pin, DIP Switch; MF: CUI Devices; SnapEDA_Link: https://www.snapeda.com/parts/DS01-254-L-01BE/CUI+Devices/view-part/?ref=snap; Purchase-URL: https://pricing.snapeda.com/search/part/DS01-254-L-01BE/?ref=eda; Price: None; Value: *; MP: DS01-254-L-01BE; Component Type: Standard; CUI_purchase_URL: https://www.cuidevices.com/product/switches/dip-switches/ds01-254-series?utm_source=snapeda.com&utm_medium=referral&utm_campaign=snapedaBOM; Case/Package: None; Design Item ID: DS01-254-L-01BE; Pins: 2; Check_prices: https://www.snapeda.com/parts/DS01-254-L-01BE/CUI+Devices/view-part/?ref=eda; Source: DS01-254-L-01BE.SchLib; Availability: In Stock
S3 = CMP-015-000000-3: as S1 on sheet FPGA; Package: None; MP: TS04-66-65-BK-100-SMT; Availability: Unavailable; Source: TS04-66-65-BK-100-SMT.SchLib; Pin Count: 4; Design Item ID: TS04-66-65-BK-100-SMT; Value: *; Component Type: Standard; Price: None
TP17-TP19 = CMP-00028-00002-3: 0.6mm round; Pins: 1
U7 = CMP-020-00023-3: Microcontroller; Clock Frequency: 170MHz; RAM Size: 128; I/Os: 107; Max Supply Voltage: 3.6V; Nominal Supply Voltage: 3.3V; Min Supply Voltage: 1.71V; Min Operating Temperature: -40°C; RoHS Compliant: Yes; Case/Package: LQFP-100
X1 = CMP-003-00028-3: Crystal, 24 MHz, +/- 10 ppm, -20 to 75 degC, 4-Pin SMD, RoHS, Tape and Reel; ESR: 80; Load Capacitance: 12pF; RoHS Compliant: Yes; Case/Package: SMD/SMT; Mounting Technology: SMT; Min Operating Temperature: -20°C; Pins: 4; Max Operating Temperature: 75°C
Y1 = CMP-003-00029-2: Crystal 32.768kHz 10ppm 7pF -40C +85C; Pins: 2

## Sheet Power Manage.SchDoc
size A3; SheetNumber: 6; SheetTotal: 9
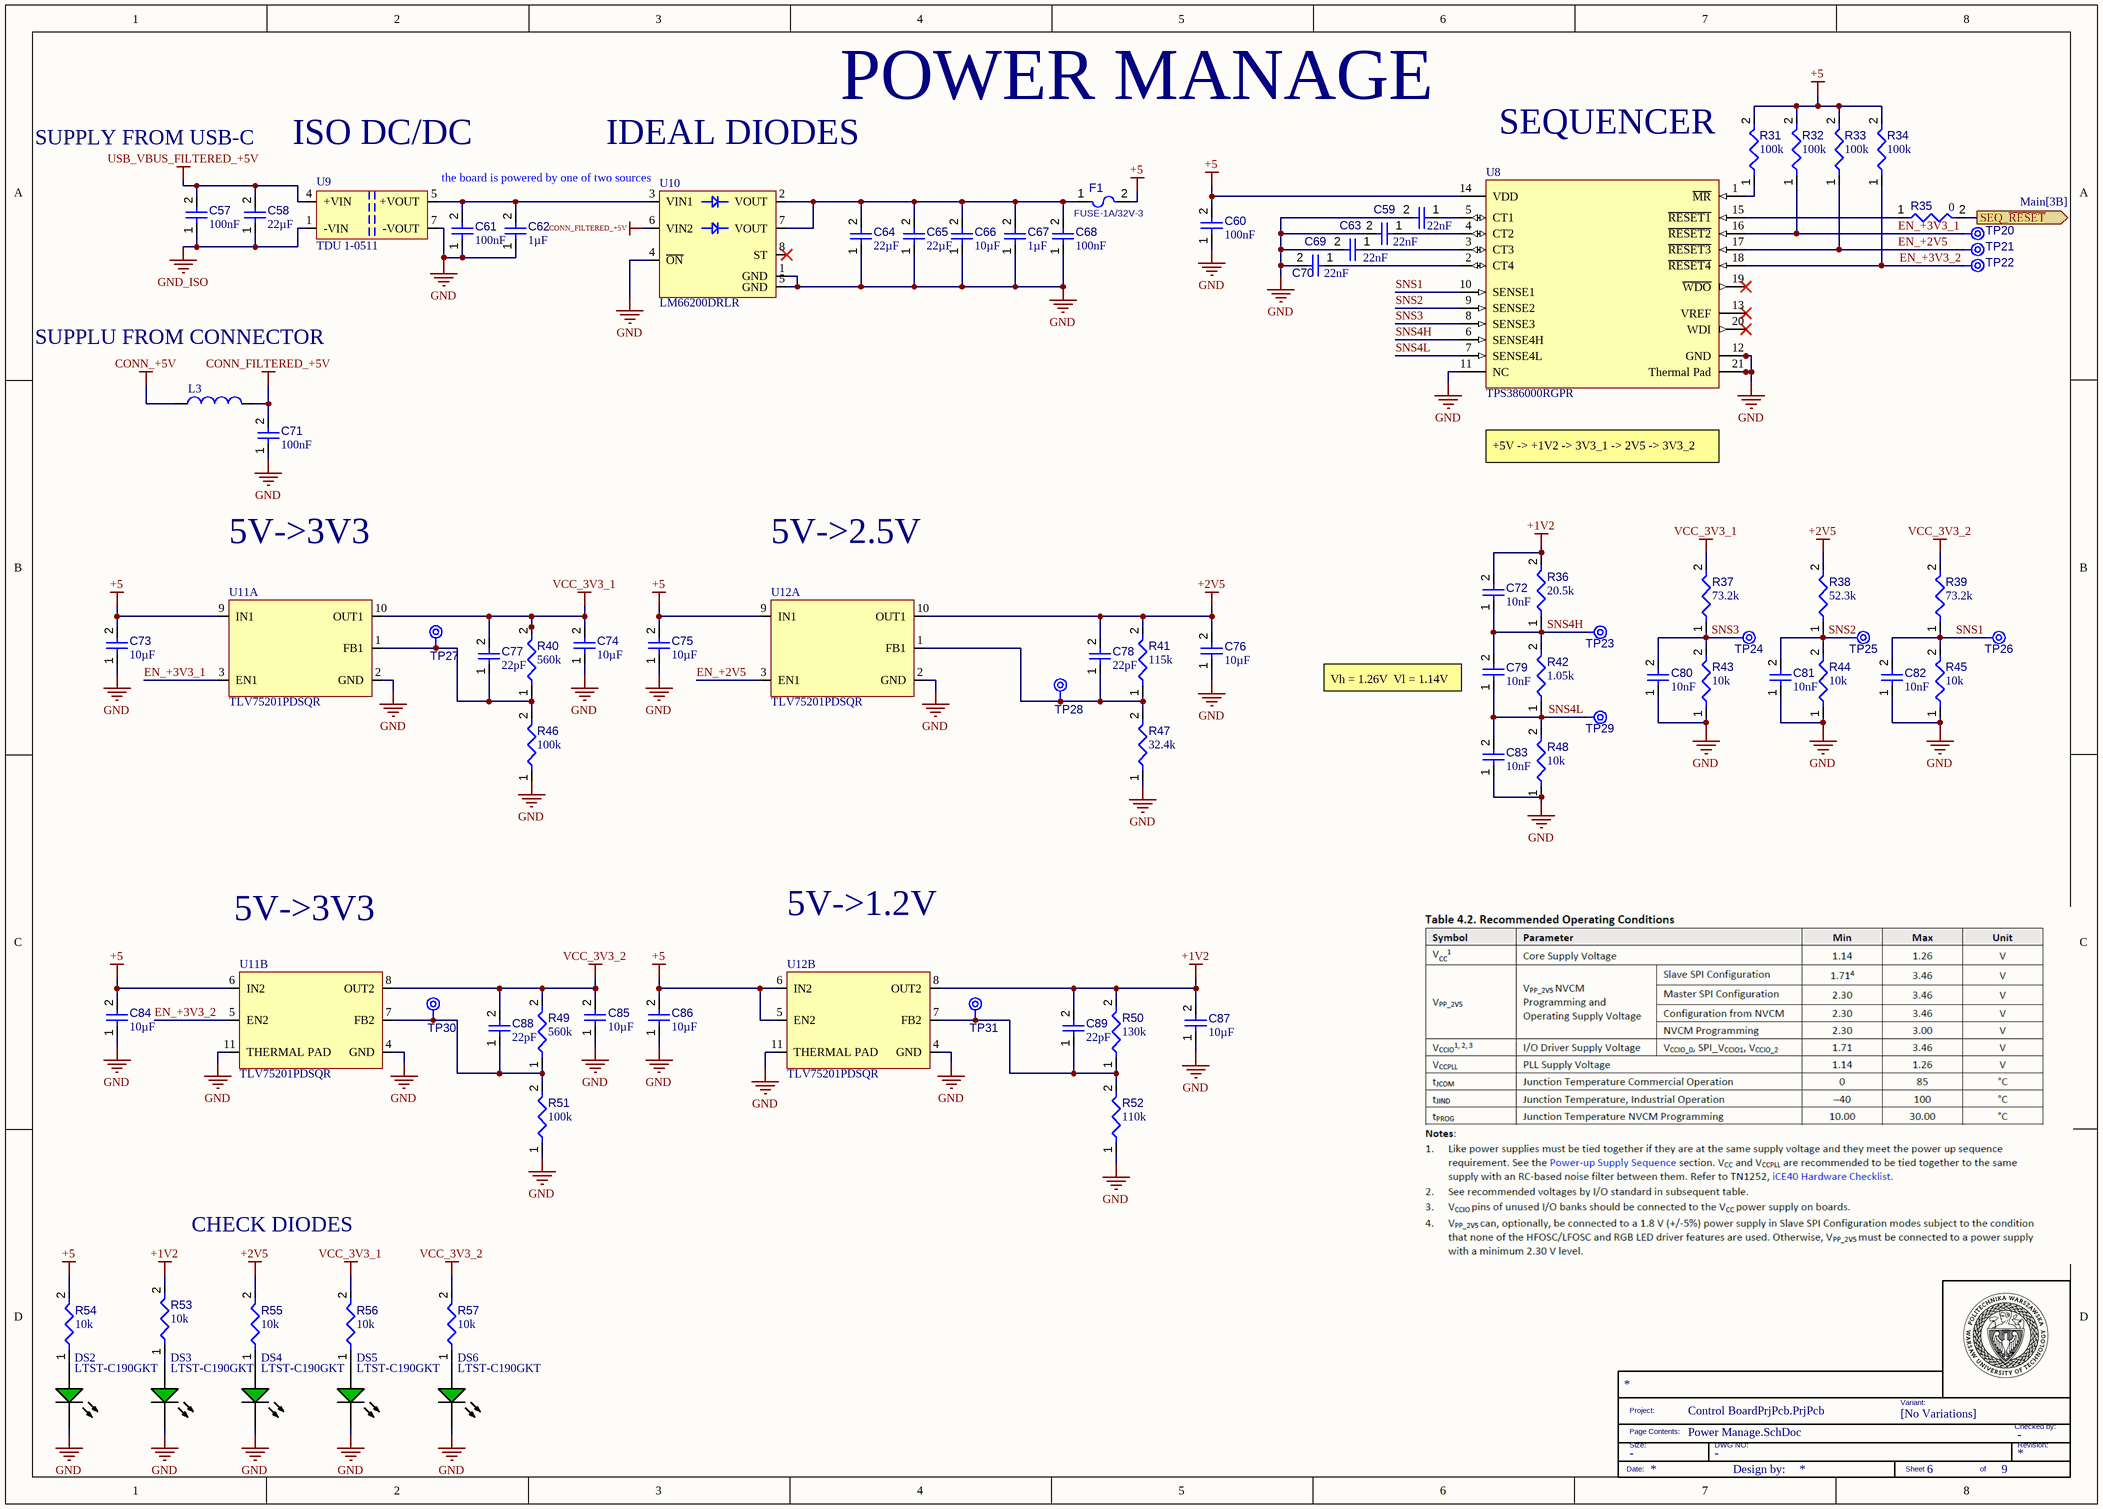
[diagram p3: Power Manage.SchDoc]

### Parts
(Parts that share a designator on the sheet are numbered #1, #2 ... from top to bottom, then left to right.)
*?#3  TITLE_BLOCK  (value not drawn)  (graphical)
C57  value 100nF  [FP-C0603C-CF-IPC_C]  (hidden comment: C0603C104K5RAC7411)
C58  value 22µF  [FP-GRM32E-0_3-0_2-IPC_C]  (hidden comment: GRM32ER71E226ME15K)
C59  value 22nF  [CAPC0402(1005)60_L]  (hidden comment: Capacitor 22nF +/-20% 10V 0402)
C60  value 100nF  [FP-C0603C-CF-IPC_C]  (hidden comment: C0603C104K5RAC7411)
C61  value 100nF  [FP-C0603C-CF-IPC_C]  (hidden comment: C0603C104K5RAC7411)
C62  value 1µF  [FP-CL10-IPC_B]  (hidden comment: CL10B105KA8NFNC)
C63  value 22nF  [CAPC0402(1005)60_L]  (hidden comment: Capacitor 22nF +/-20% 10V 0402)
C64  value 22µF  [FP-GRM32E-0_3-0_2-IPC_C]  (hidden comment: GRM32ER71E226ME15K)
C65  value 22µF  [FP-GRM32E-0_3-0_2-IPC_C]  (hidden comment: GRM32ER71E226ME15K)
C66  value 10µF  [CAPC3216X18N]  (hidden comment: CL31B106KAHNNNE)
C67  value 1µF  [FP-CL10-IPC_C]  (hidden comment: CL10B105KA8NFNC)
C68  value 100nF  [FP-C0603C-CF-IPC_C]  (hidden comment: C0603C104K5RAC7411)
C69  value 22nF  [CAPC0402(1005)60_L]  (hidden comment: Capacitor 22nF +/-20% 10V 0402)
C70  value 22nF  [CAPC0402(1005)60_L]  (hidden comment: Capacitor 22nF +/-20% 10V 0402)
C71  value 100nF  [FP-C0603C-CF-IPC_B]  (hidden comment: C0603C104K5RAC7411)
C72  value 10nF  [CAPC1608X90X35LL10T15]  (hidden comment: GCM188R71H103KA37J)
C73  value 10µF  [CAPC3216X18N]  (hidden comment: CL31B106KAHNNNE)
C74  value 10µF  [CAPC3216X18N]  (hidden comment: CL31B106KAHNNNE)
C75  value 10µF  [CAPC3216X18N]  (hidden comment: CL31B106KAHNNNE)
C76  value 10µF  [CAPC3216X18N]  (hidden comment: CL31B106KAHNNNE)
C77  value 22pF  [CAPC0402(1005)60_L]  (hidden comment: Capacitor 22pF +/-10% 50V 0402)
C78  value 22pF  [CAPC0402(1005)60_L]  (hidden comment: Capacitor 22pF +/-10% 50V 0402)
C79  value 10nF  [CAPC1608X90X35LL10T15]  (hidden comment: GCM188R71H103KA37J)
C80  value 10nF  [CAPC1608X90X35LL10T15]  (hidden comment: GCM188R71H103KA37J)
C81  value 10nF  [CAPC1608X90X35LL10T15]  (hidden comment: GCM188R71H103KA37J)
C82  value 10nF  [CAPC1608X90X35LL10T15]  (hidden comment: GCM188R71H103KA37J)
C83  value 10nF  [CAPC1608X90X35LL10T15]  (hidden comment: GCM188R71H103KA37J)
C84  value 10µF  [CAPC3216X18N]  (hidden comment: CL31B106KAHNNNE)
C85  value 10µF  [CAPC3216X18N]  (hidden comment: CL31B106KAHNNNE)
C86  value 10µF  [CAPC3216X18N]  (hidden comment: CL31B106KAHNNNE)
C87  value 10µF  [CAPC3216X18N]  (hidden comment: CL31B106KAHNNNE)
C88  value 22pF  [CAPC0402(1005)60_L]  (hidden comment: Capacitor 22pF +/-10% 50V 0402)
C89  value 22pF  [CAPC0402(1005)60_L]  (hidden comment: Capacitor 22pF +/-10% 50V 0402)
DS2  LTST-C190GKT  [LTST-C190GKT_V]
DS3  LTST-C190GKT  [LTST-C190GKT_V]
DS4  LTST-C190GKT  [LTST-C190GKT_V]
DS5  LTST-C190GKT  [LTST-C190GKT_V]
DS6  LTST-C190GKT  [LTST-C190GKT_V]
F1  FUSE-1A/32V-3  [LFUS-467_V]
L3  MPZ1608Y101BTA00  [FP-MPZ1608-0_8-IPC_A]  (value not drawn)
R31  value 100k  [RESC1608X55X25LL10T15]  (hidden comment: Resistor 100k +/-1% 0603 100 mW)
R32  value 100k  [RESC1608X55X25LL10T15]  (hidden comment: Resistor 100k +/-1% 0603 100 mW)
R33  value 100k  [RESC1608X55X25LL10T15]  (hidden comment: Resistor 100k +/-1% 0603 100 mW)
R34  value 100k  [RESC1608X55X25LL10T15]  (hidden comment: Resistor 100k +/-1% 0603 100 mW)
R35  value 0  [RESC0603(1608)_L]  (hidden comment: 0R3J)
R36  value 20.5k  [RESC1608X06N]  (hidden comment: CRCW060320K5FKEA)
R37  value 73.2k  [RESC1608X55X30LL15T15]  (hidden comment: ERJ-3EKF7322V)
R38  value 52.3k  [RESC1608X06N]  (hidden comment: CRCW060352K3FKEA)
R39  value 73.2k  [RESC1608X55X30LL15T15]  (hidden comment: ERJ-3EKF7322V)
R40  value 560k  [RESC1608X06N]  (hidden comment: CRCW0603560KFKEAC)
R41  value 115k  [RESC1608X06N]  (hidden comment: CRCW0603115KFKEA)
R42  value 1.05k  [RESC1608X06N]  (hidden comment: CRCW06031K05FKEAC)
R43  value 10k  [RESC1608X05N]  (hidden comment: CRCW060310K0FKTC)
R44  value 10k  [RESC1608X05N]  (hidden comment: CRCW060310K0FKTC)
R45  value 10k  [RESC1608X05N]  (hidden comment: CRCW060310K0FKTC)
R46  value 100k  [RESC1608X55X25LL10T15]  (hidden comment: Resistor 100k +/-1% 0603 100 mW)
R47  value 32.4k  [RESC1608X06N]  (hidden comment: CRCW060332K4FKEA)
R48  value 10k  [RESC1608X05N]  (hidden comment: CRCW060310K0FKTC)
R49  value 560k  [RESC1608X06N]  (hidden comment: CRCW0603560KFKEAC)
R50  value 130k  [RESC1608X06N]  (hidden comment: CRCW0603130KFKEAC)
R51  value 100k  [RESC1608X55X25LL10T15]  (hidden comment: Resistor 100k +/-1% 0603 100 mW)
R52  value 110k  [RESC1608X06N]  (hidden comment: CRCW0603110KFKEAC)
R53  value 10k  [RESC1608X05N]  (hidden comment: CRCW060310K0FKTC)
R54  value 10k  [RESC1608X05N]  (hidden comment: CRCW060310K0FKTC)
R55  value 10k  [RESC1608X05N]  (hidden comment: CRCW060310K0FKTC)
R56  value 10k  [RESC1608X05N]  (hidden comment: CRCW060310K0FKTC)
R57  value 10k  [RESC1608X05N]  (hidden comment: CRCW060310K0FKTC)
TP20  TPAD6R  [TP06R]  (value not drawn)  (no BOM)
TP21  TPAD6R  [TP06R]  (value not drawn)  (no BOM)
TP22  TPAD6R  [TP06R]  (value not drawn)  (no BOM)
TP23  TPAD6R  [TP06R]  (value not drawn)  (no BOM)
TP24  TPAD6R  [TP06R]  (value not drawn)  (no BOM)
TP25  TPAD6R  [TP06R]  (value not drawn)  (no BOM)
TP26  TPAD6R  [TP06R]  (value not drawn)  (no BOM)
TP27  TPAD6R  [TP06R]  (value not drawn)  (no BOM)
TP28  TPAD6R  [TP06R]  (value not drawn)  (no BOM)
TP29  TPAD6R  [TP06R]  (value not drawn)  (no BOM)
TP30  TPAD6R  [TP06R]  (value not drawn)  (no BOM)
TP31  TPAD6R  [TP06R]  (value not drawn)  (no BOM)
U8  TPS386000RGPR  [FP-RGP0020A-IPC_C]
U9  TDU 1-0511  [RELAY_TDU1_TRP]
U10  LM66200DRLR  [LM66200DRLR-Footprint-1]
U11  TLV75201PDSQR  [SON40P200X80_HS-11N]  (parts A,B of 2)
U12  TLV75201PDSQR  [SON40P200X80_HS-11N]  (parts A,B of 2)

### Ports
SEQ_~{RESET} (out, see Main[3B])

### Nets
+1V2: C72.2 C87.2 C89.2 R36.2 R50.2 R53.2 U12.8(OUT2)
+2V5: C76.2 C78.2 R38.2 R41.2 R55.2 U12.10(OUT1)
+5: C60.2 C73.2 C75.2 C84.2 C86.2 F1.2 R31.2 R32.2 R33.2 R34.2 R54.2 U8.14(VDD) U11.6(IN2) U11.9(IN1) U12.5(EN2) U12.6(IN2) U12.9(IN1)
CONN_+5V: L3.1
CONN_FILTERED_+5V: C71.2 L3.2 U10.6(VIN2)
GND: C59.2 C60.1 C61.1 C62.1 C63.2 C64.1 C65.1 C66.1 C67.1 C68.1 C69.2 C70.2 C71.1 C73.1 C74.1 C75.1 C76.1 C80.1 C81.1 C82.1 C83.1 C84.1 C85.1 C86.1 C87.1 DS2.2(K) DS3.2(K) DS4.2(K) DS5.2(K) DS6.2(K) R43.1 R44.1 R45.1 R46.1 R47.1 R48.1 R51.1 R52.1 U8.11(NC) U8.12(GND) U8.21(Thermal_Pad) U9.7(-VOUT) U10.1(GND) U10.4(~{ON}) U10.5(GND) U11.2(GND) U11.4(GND) U11.11(THERMAL_PAD) U12.2(GND) U12.4(GND) U12.11(THERMAL_PAD)
GND_ISO: C57.1 C58.1 U9.1(-VIN)
USB_VBUS_FILTERED_+5V: C57.2 C58.2 U9.4(+VIN)
VCC_3V3_1: C74.2 C77.2 R37.2 R40.2 R56.2 U11.10(OUT1)
VCC_3V3_2: C85.2 C88.2 R39.2 R49.2 R57.2 U11.8(OUT2)
~{CRESET}: R35.2 ; port SEQ_~{RESET}
EN_+2V5: R33.1 TP21.1(TP) U8.17(~{RESET3}) U12.3(EN1)
EN_+3V3_1: R32.1 TP20.1(TP) U8.16(~{RESET2}) U11.3(EN1)
EN_+3V3_2: R34.1 TP22.1(TP) U8.18(~{RESET4}) U11.5(EN2)
SNS1: C82.2 R39.1 R45.2 TP26.1(TP) U8.10(SENSE1)
SNS2: C81.2 R38.1 R44.2 TP25.1(TP) U8.9(SENSE2)
SNS3: C80.2 R37.1 R43.2 TP24.1(TP) U8.8(SENSE3)
SNS4H: C72.1 C79.2 R36.1 R42.2 TP23.1(TP) U8.6(SENSE4H)
SNS4L: C79.1 C83.2 R42.1 R48.2 TP29.1(TP) U8.7(SENSE4L)
NetC59_1: C59.1 U8.5(CT1)
NetC61_2: C61.2 C62.2 U9.5(+VOUT) U10.3(VIN1)
NetC63_1: C63.1 U8.4(CT2)
NetC64_2: C64.2 C65.2 C66.2 C67.2 C68.2 F1.1 U10.2(VOUT) U10.7(VOUT)
NetC69_1: C69.1 U8.3(CT3)
NetC70_1: C70.1 U8.2(CT4)
NetC77_1: C77.1 R40.1 R46.2 TP27.1(TP) U11.1(FB1)
NetC78_1: C78.1 R41.1 R47.2 TP28.1(TP) U12.1(FB1)
NetC88_1: C88.1 R49.1 R51.2 TP30.1(TP) U11.7(FB2)
NetC89_1: C89.1 R50.1 R52.2 TP31.1(TP) U12.7(FB2)
NetDS2_1: DS2.1(A) R54.1
NetDS3_1: DS3.1(A) R53.1
NetDS4_1: DS4.1(A) R55.1
NetDS5_1: DS5.1(A) R56.1
NetDS6_1: DS6.1(A) R57.1
NetR31_1: R31.1 U8.1(~{MR})
NetR35_1: R35.1 U8.15(~{RESET1})

Not connected (* = marked no-connect by the designer): U8 13(VREF)* 19(~{WDO})* 20(WDI)*; U10 8(ST)*

### Notes on the sheet
- POWER MANAGE
- SUPPLY FROM USB-C
- ISO DC/DC
- the board is powered by one of two sources
- (near U10) IDEAL DIODES
- (near U8) SEQUENCER
- SUPPLU FROM CONNECTOR
- +5V -> +1V2 -> 3V3_1 -> 2V5 -> 3V3_2
- 5V->3V3
- 5V->2.5V
- (near C79) Vh = 1.26V  Vl = 1.14V
- 5V->1.2V
- CHECK DIODES
- (in symbol CMP-003-000005-7) Variant:; Project:; [No Variations]; Checked by:; Page Contents:; Size:; DWG NO:; Revision:; Date:; Design by:; Sheet; of

### Library data of the parts
*?#3 = CMP-003-000005-7: TITLEBLOCK; DWG NO: -; Size: -; Checked by: -; Design Item ID: TITLE_BLOCK; Source: TITLEBLOCK.SchLib
C57 C60 C61 C68 C71 = CMP-001-00086-8: as C25 on sheet FPGA; Capacitor Type: Ceramic; Max Operating Temperature: 125°C; Case/Package: 0603; Pins: 2; Min Operating Temperature: -55°C; RoHS Compliant: Yes; Mounting Technology: Surface Mount
C58 C64 C65 = CMP-001-00084-6: Ceramic Capacitor, Multilayer, Ceramic, 25V, 20% +Tol, 20% -Tol, X7R, 15% TC, 22uF, Surface Mount, 1210; Pins: 2; RoHS Compliant: Yes; Max Operating Temperature: 125°C; Min Operating Temperature: -55°C; Capacitor Type: Ceramic; Case/Package: 1210; Mounting Technology: Surface Mount
C59 C63 C69 C70 = CMP-001-00062-4: Chip Capacitor, 22nF +/-20%, 10V, 0402, Thickness 0.6 mm; Tolerance: 10%; Min Operating Temperature: -55°C; Case/Package: 0402; Pins: 2; Max Operating Temperature: 85°C; Mounting Technology: SMT; Voltage Rating: 10V
C62 C67 = CMP-001-00085-5: as C18 on sheet FPGA; Max Operating Temperature: 125°C; Pins: 2; RoHS Compliant: Yes; Min Operating Temperature: -55°C; Capacitor Type: Ceramic; Mounting Technology: Surface Mount; Case/Package: 0603
C66 C73-C76 C84-C87 = CMP-001-00088-3: Ceramic Capacitor, Multilayer, Ceramic, 25V, 10% +Tol, 10% -Tol, X7R, 15% TC, 10uF, Surface Mount, 1206; Max Operating Temperature: 125°C; Mounting Technology: Surface Mount; Pins: 2; Case/Package: 1206; Min Operating Temperature: -55°C; Voltage Rating: 25V; Capacitor Type: Ceramic; RoHS Compliant: Yes
C72 C79-C83 = CMP-001-00231-2: as C21 on sheet FPGA; Min Operating Temperature: -55°C; Voltage Rating: 50V; Max Operating Temperature: 125°C; Tolerance: 10%; Capacitor Type: Ceramic; Mounting Technology: Surface Mount; RoHS Compliant: Yes; Case/Package: 0603; Pins: 2
C77 C78 C88 C89 = CMP-001-00073-4: Chip Capacitor, 22pF +/-10%, 50V, 0402, Thickness 0.6 mm; Tolerance: 10%; Pins: 2; Voltage Rating: 50V; Max Operating Temperature: 85°C; Min Operating Temperature: -55°C; Mounting Technology: SMT; Case/Package: 0402
DS2-DS6 = CMP-007-00022-2: as DS1 on sheet FPGA; Manufacturer URL: http://www.us.liteon.com/; RoHS Compliant: True; Colour: Green; Package Description: 2-Pin Surface Mount Device, Body 1.6 x 0.8 mm; Datasheet URL: http://datasheet.octopart.com/LTST-C190GKT-Lite-On-datasheet-158530.pdf; Datasheet Version: Dec-06; Mounting Technology: SM; Case/Package: 0603; Package Reference: C190GKT; Packaging: TapeandReel; Min Operating Temperature: -55°C; Nominal Vf: 2.1V; Package Quantity: 3000; Illumination Colour: Green; Max Operating Temperature: 85°C; Pins: 2
F1 = CMP-005-00012-2: Fast Acting Fuse, 1 A, 32 V, -55 to 90 degC, 2-Pin SMD, RoHS, Tape and Reel; Current Rating: 1A; Case/Package: LFUS-467; Pins: 2
L3 = CMP-006-00024-1: Ferrite Chip, 1 Function(s), 2A, 2 Pin(s); Tolerance: 25%; Current Rating: 2A; RoHS Compliant: Yes; Pins: 2; Max Operating Temperature: 125°C; Mounting Technology: Surface Mount; Case/Package: 0603; Min Operating Temperature: -55°C; Max Current Rating: 2A
R31-R34 R46 R51 = CMP-009-00023-6: Chip Resistor, 100 KOhm, +/- 1%, 0.1 W, -55 to 155 degC, 0603 (1608 Metric); Voltage Rating: 50V; Power: 100mW; Max Operating Temperature: 155°C; RoHS Compliant: True; Tolerance: 1%; Pins: 2; Case/Package: 0603; Mounting Technology: SM; Min Operating Temperature: -55°C
R35 = CMP-009-00063-3: Jumper 0603 (1608 Metric); Case/Package: 0603; Mounting Technology: SMT; Pins: 2
R36 = CMP-009-00210-3: Fixed Resistor, Metal Glaze/thick Film, 0.1W, 20500ohm, 75V, 1% +/-Tol, 100ppm/Cel, Surface Mount, 0603; Power: 100mW; Tolerance: 1%; RoHS Compliant: Yes; Max Operating Temperature: 155°C; Pins: 2; Min Operating Temperature: -55°C; Mounting Technology: Surface Mount; Case/Package: 0603
R37 R39 = CMP-009-00178-2: Fixed Resistor, Metal Glaze/thick Film, 0.1W, 73200ohm, 75V, 1% +/-Tol, 100ppm/Cel, Surface Mount, 0603; Power: 100mW; Mounting Technology: Surface Mount; RoHS Compliant: Yes; Max Operating Temperature: 155°C; Pins: 2; Tolerance: 1%; Min Operating Temperature: -55°C; Voltage Rating: 75V; Case/Package: 0603
R38 = CMP-009-00206-3: Fixed Resistor, Metal Glaze/thick Film, 0.1W, 52300ohm, 75V, 1% +/-Tol, 100ppm/Cel, Surface Mount, 0603; Power: 100mW; Pins: 2; Tolerance: 1%; Case/Package: 0603; Min Operating Temperature: -55°C; RoHS Compliant: Yes; Max Operating Temperature: 155°C; Mounting Technology: Surface Mount
R40 R49 = CMP-009-00200-3: Fixed Resistor, Metal Glaze/thick Film, 0.1W, 560000ohm, 75V, 1% +/-Tol, 100ppm/Cel, Surface Mount, 0603; Power: 100mW; Min Operating Temperature: -55°C; Case/Package: 0603; RoHS Compliant: Yes; Max Operating Temperature: 155°C; Pins: 2; Tolerance: 1%
R41 = CMP-009-00203-3: Fixed Resistor, Metal Glaze/thick Film, 0.1W, 115000ohm, 75V, 1% +/-Tol, 100ppm/Cel, Surface Mount, 0603; Power: 100mW; Case/Package: 0603; RoHS Compliant: Yes; Pins: 2; Min Operating Temperature: -55°C; Max Operating Temperature: 155°C; Tolerance: 1%; Mounting Technology: Surface Mount
R42 = CMP-009-00209-3: Fixed Resistor, Metal Glaze/thick Film, 0.1W, 1050ohm, 75V, 1% +/-Tol, 100ppm/Cel, Surface Mount, 0603; Power: 100mW; Tolerance: 1%; Mounting Technology: Surface Mount; Pins: 2; Min Operating Temperature: -55°C; Max Operating Temperature: 155°C; RoHS Compliant: Yes; Case/Package: 0603
R43-R45 R48 = CMP-009-00187-3: as R24 on sheet FPGA; Voltage Rating: 75V; Case/Package: 0603; Tolerance: 1%; Min Operating Temperature: -55°C; Mounting Technology: Surface Mount; Max Operating Temperature: 155°C; RoHS Compliant: No; Pins: 2
R47 = CMP-009-00204-3: Fixed Resistor, Metal Glaze/thick Film, 0.1W, 32400ohm, 75V, 1% +/-Tol, 100ppm/Cel, Surface Mount, 0603; Power: 100mW; Tolerance: 1%; Min Operating Temperature: -55°C; Mounting Technology: Surface Mount; Pins: 2; Max Operating Temperature: 155°C; RoHS Compliant: Yes; Case/Package: 0603
R50 = CMP-009-00202-3: Fixed Resistor, Metal Glaze/thick Film, 0.1W, 130000ohm, 75V, 1% +/-Tol, 100ppm/Cel, Surface Mount, 0603; Power: 100mW; Case/Package: 0603; Min Operating Temperature: -55°C; Pins: 2; Max Operating Temperature: 155°C; Tolerance: 1%; RoHS Compliant: Yes
R52 = CMP-009-00201-3: Fixed Resistor, Metal Glaze/thick Film, 0.1W, 110000ohm, 75V, 1% +/-Tol, 100ppm/Cel, Surface Mount, 0603; Power: 100mW; RoHS Compliant: Yes; Max Operating Temperature: 155°C; Case/Package: 0603; Pins: 2; Min Operating Temperature: -55°C; Tolerance: 1%
R53-R57 = CMP-009-00187-2: as R22 on sheet FPGA; Voltage Rating: 75V; Case/Package: 0603; Tolerance: 1%; Min Operating Temperature: -55°C; Mounting Technology: Surface Mount; Max Operating Temperature: 155°C; RoHS Compliant: No; Pins: 2
TP20-TP31 = CMP-00028-00002-3: 0.6mm round; Pins: 1
U8 = CMP-031-00020-3: Power Supply Management Circuit, Adjustable, 4 Channel, PQCC20; Max Supply Voltage: 6.5V; Min Supply Voltage: 1.8V; Case/Package: HVQCCN; RoHS Compliant: Yes; Min Operating Temperature: -40°C; Max Operating Temperature: 125°C; Pins: 20
U9 = CMP-019-00050-2: DC-DC Converter, 1W, 4.5-5.5Vin, 5Vout, 200mA, Encapsulated DIP8, TDU 1 Series
U10 = CMP-031-00022-3: 1.6-V to 5.5-V, 40-mΩ, 2.5-A, low-IQ, dual ideal diode 8-SOT-5X3 -40 to 125; Max Supply Voltage: 5.5V; Min Supply Voltage: 0V; Case/Package: SOT-5X3-8; Max Operating Temperature: 125°C; Pins: 8
U11 U12 = CMP-031-00021-3: Adjustable Positive LDO Regulator, 2 Output, 0.55V1 Min, 0.55V2 Min, 5.5V1 Max, 5.5V2 Max, PDSO10

## Sheet Mechanical.SchDoc
size A4; SheetNumber: 9; SheetTotal: 9
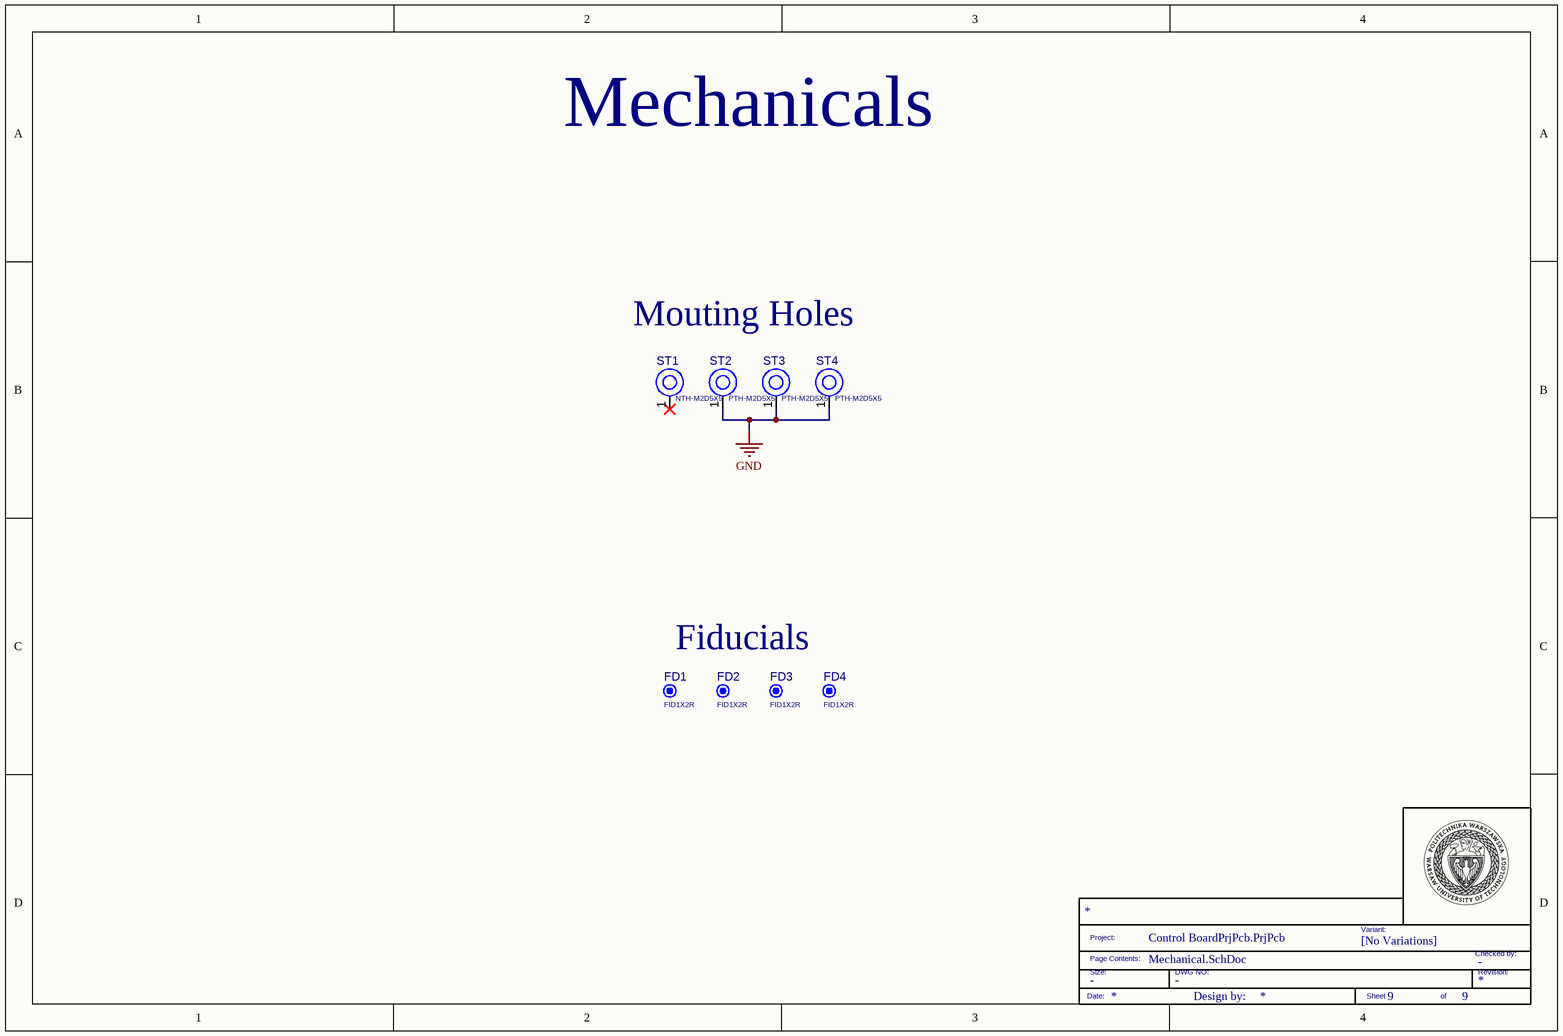
[diagram p4: Mechanical.SchDoc]

### Parts
(Parts that share a designator on the sheet are numbered #1, #2 ... from top to bottom, then left to right.)
*?#4  TITLE_BLOCK  (value not drawn)  (graphical)
FD1  FID1X2R  [FID1X2R]  (no BOM)
FD2  FID1X2R  [FID1X2R]  (no BOM)
FD3  FID1X2R  [FID1X2R]  (no BOM)
FD4  FID1X2R  [FID1X2R]  (no BOM)
ST1  NTH-M2D5X5  [PTH-M2D5X5]
ST2  PTH-M2D5X5  [PTH-M2D5X5]
ST3  PTH-M2D5X5  [PTH-M2D5X5]
ST4  PTH-M2D5X5  [PTH-M2D5X5]

### Nets
GND: ST2.1(H1) ST3.1(H1) ST4.1(H1)

Not connected (* = marked no-connect by the designer): ST1 1(H1)*

### Notes on the sheet
- Mechanicals
- Mouting Holes
- Fiducials
- (in symbol CMP-003-000005-7) Variant:; Project:; [No Variations]; Checked by:; Page Contents:; Size:; DWG NO:; Revision:; Date:; Design by:; Sheet; of

### Library data of the parts
*?#4 = CMP-003-000005-7: TITLEBLOCK; DWG NO: -; Size: -; Checked by: -; Design Item ID: TITLE_BLOCK; Source: TITLEBLOCK.SchLib
FD1-FD4 = CMP-00028-00005-2: Fiducial - Round 1x2mm; Pins: 0
ST1 = CMP-00028-00009-2: M2 PTH (2.5mm), 5mm pad; Pins: 1
ST2-ST4 = CMP-00028-00004-2: M2 PTH (2.5mm), 5mm pad; Pins: 1